# EAGLE design hybrid_lower_pcb3_3 (EAGLE 9.2.1)

## Sheet 1 of 8: micro,xbee,sd
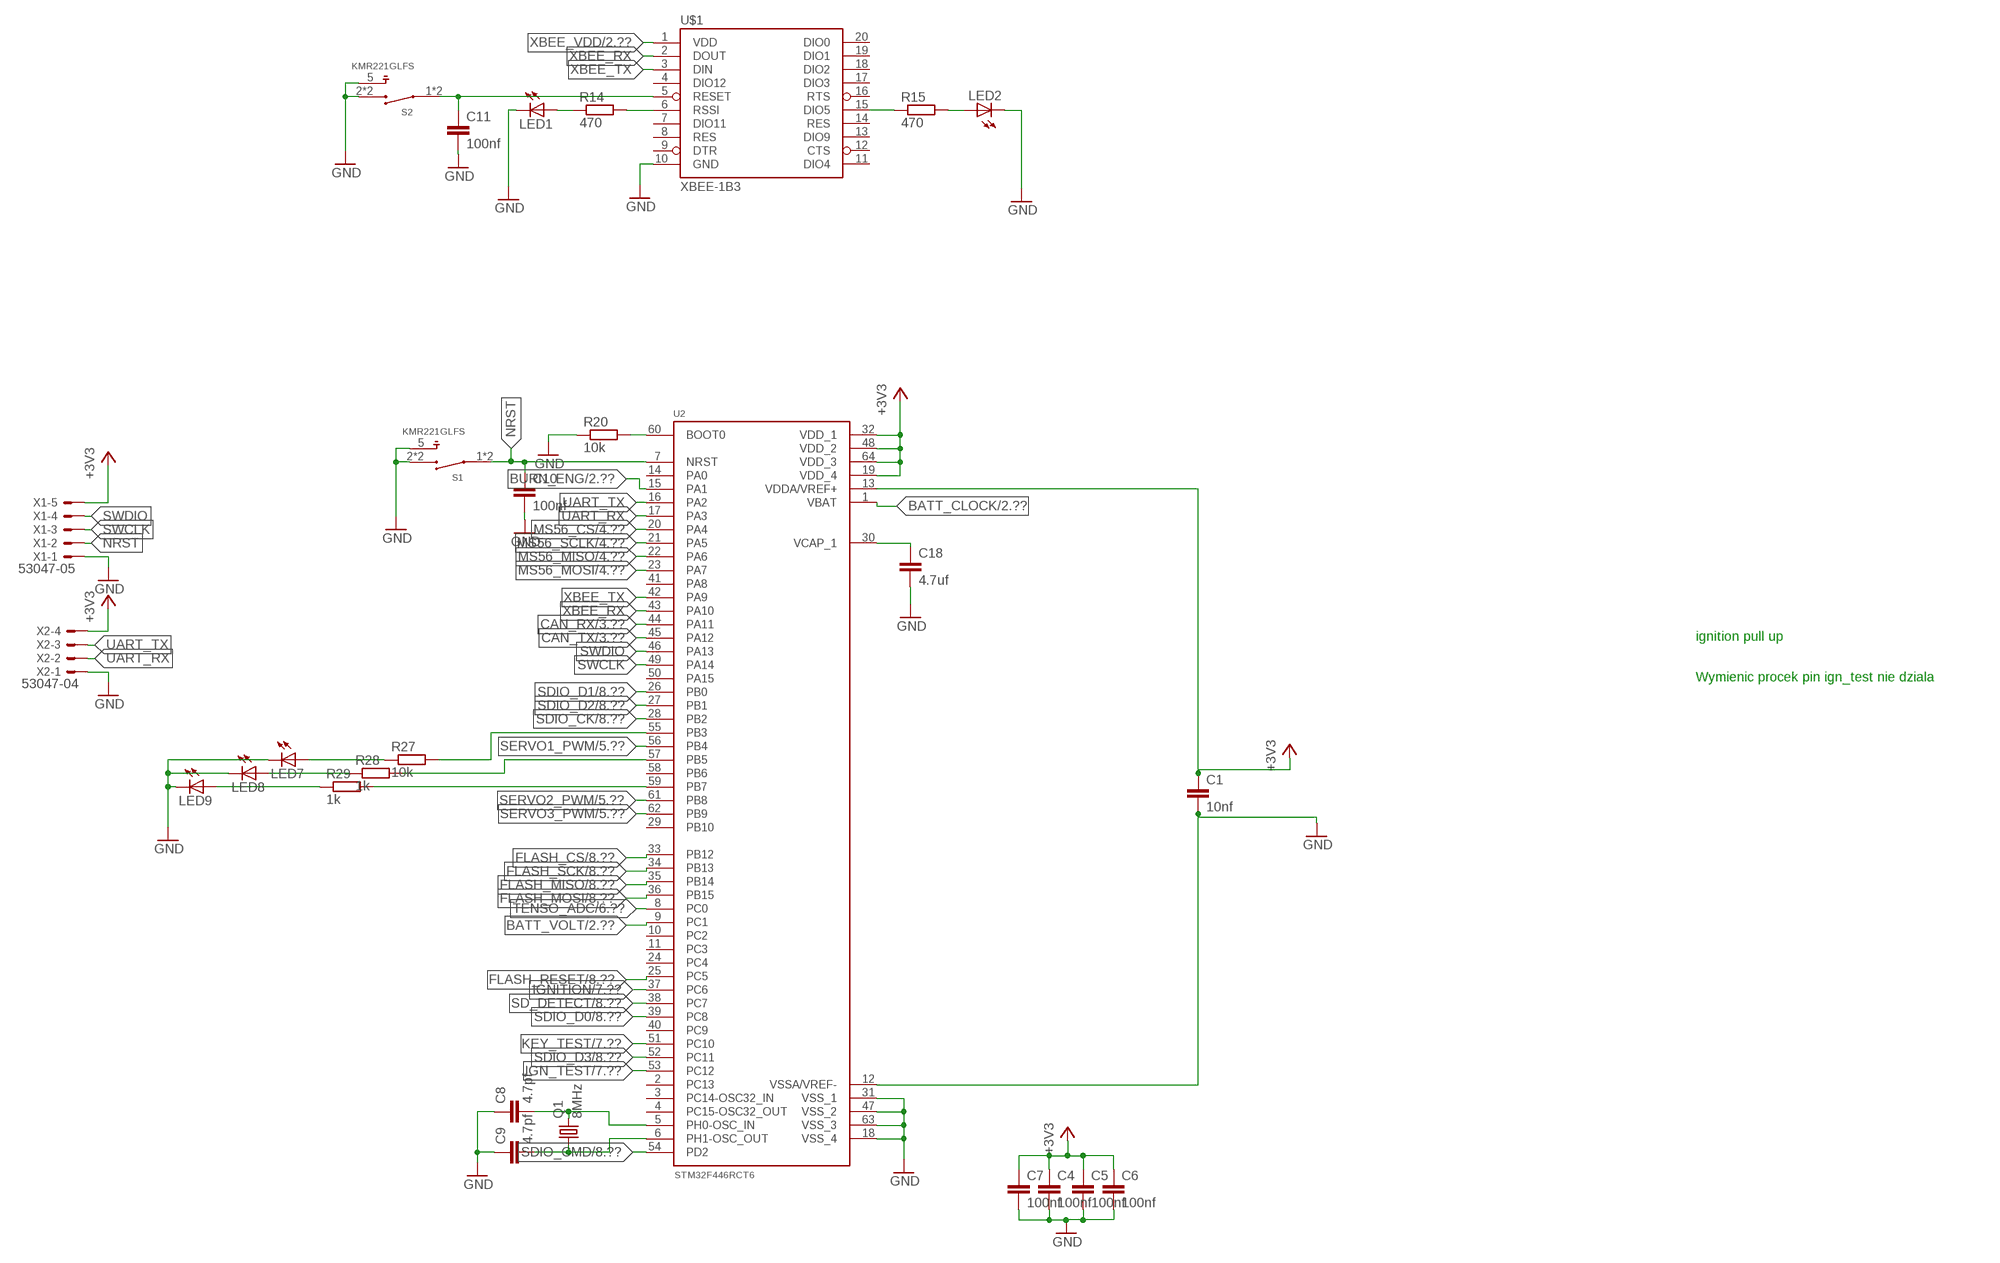
[diagram p0: schematic, sheet 1]

### Parts
C1  10nf  C-EUC0603  [C0603]
C4  100nf  C-EUC0603  [C0603]
C5  100nf  C-EUC0603  [C0603]
C6  100nf  C-EUC0603  [C0603]
C7  100nf  C-EUC0603  [C0603]
C8  4.7pf  C-EUC0603  [C0603]
C9  4.7pf  C-EUC0603  [C0603]
C10  100nf  C-EUC0603  [C0603]
C11  100nf  C-EUC0603  [C0603]
C18  4.7uf  C-EUC0805  [C0805]
LED1  LED0603  [LED-0603]
LED2  LED0603  [LED-0603]
LED7  LED0603  [LED-0603]
LED8  LED0603  [LED-0603]
LED9  LED0603  [LED-0603]
Q1  8MHz  CRYSTALCTS406  [CTS406]
R14  470  R-EU_R0603  [R0603]
R15  470  R-EU_R0603  [R0603]
R20  10k  R-EU_R0603  [R0603]
R27  10k  R-EU_R0603  [R0603]
R28  1k  R-EU_R0603  [R0603]
R29  1k  R-EU_R0603  [R0603]
S1  KMR221GLFS  [SW_KMR221GLFS]
S2  KMR221GLFS  [SW_KMR221GLFS]
U2  STM32F446RCT6  [QFP50P1200X1200X160-64N]
U$1  XBEE-1B3  [XBEE-SMD]
X1  53047-05  [53047-05]
X2  53047-04  [53047-04]

### Nets
+3V3: C1.1 C4.1 C5.1 C6.1 C7.1 U2.13(VDDA/VREF+) U2.19(VDD_4) U2.32(VDD_1) U2.48(VDD_2) U2.64(VDD_3) X1.5 X2.4 ; also sheet 2,3,4,5,7,8
BATT_CLOCK: U2.1(VBAT) ; also sheet 2
BATT_VOLT: U2.9(PC1) ; also sheet 2
BURN_ENG: U2.15(PA1) ; also sheet 2
CAN_RX: U2.44(PA11) ; also sheet 3
CAN_TX: U2.45(PA12) ; also sheet 3
DUPA: C11.1 S2.1 S2.4 U$1.5(RESET)
FLASH_CS: U2.33(PB12) ; also sheet 8
FLASH_MISO: U2.35(PB14) ; also sheet 8
FLASH_MOSI: U2.36(PB15) ; also sheet 8
FLASH_RESET: U2.25(PC5) ; also sheet 8
FLASH_SCK: U2.34(PB13) ; also sheet 8
GND: C1.2 C4.2 C5.2 C6.2 C7.2 C8.1 C9.1 C10.2 C11.2 C18.2 LED1.C LED2.C LED7.C LED8.C LED9.C R20.1 S1.2 S1.3 S1.5 S2.2 S2.3 S2.5 U2.12(VSSA/VREF-) U2.18(VSS_4) U2.31(VSS_1) U2.47(VSS_2) U2.63(VSS_3) U$1.10(GND) X1.1 X2.1 ; also sheet 2,3,4,5,6,7,8
IGN_TEST: U2.53(PC12) ; also sheet 7
IGNITION: U2.37(PC6) ; also sheet 7
KEY_TEST: U2.51(PC10) ; also sheet 7
MS56_CS: U2.20(PA4) ; also sheet 4
MS56_MISO: U2.22(PA6) ; also sheet 4
MS56_MOSI: U2.23(PA7) ; also sheet 4
MS56_SCLK: U2.21(PA5) ; also sheet 4
N$2: C18.1 U2.30(VCAP_1)
N$7: LED1.A R14.1
N$8: C8.2 Q1.3 U2.5(PH0-OSC_IN)
N$9: C9.2 Q1.1 U2.6(PH1-OSC_OUT)
N$11: LED2.A R15.2
N$18: R14.2 U$1.6(RSSI)
N$19: R15.1 U$1.15(DIO5)
N$29: R20.2 U2.60(BOOT0)
N$30: R27.2 U2.55(PB3)
N$33: R28.2 U2.57(PB5)
N$34: R29.2 U2.59(PB7)
N$36: LED7.A R27.1
N$37: LED8.A R28.1
N$38: LED9.A R29.1
NRST: C10.1 S1.1 S1.4 U2.7(NRST) X1.2
SD_DETECT: U2.38(PC7) ; also sheet 8
SDIO_CK: U2.28(PB2) ; also sheet 8
SDIO_CMD: U2.54(PD2) ; also sheet 8
SDIO_D0: U2.39(PC8) ; also sheet 8
SDIO_D1: U2.26(PB0) ; also sheet 8
SDIO_D2: U2.27(PB1) ; also sheet 8
SDIO_D3: U2.52(PC11) ; also sheet 8
SERVO1_PWM: U2.56(PB4) ; also sheet 5
SERVO2_PWM: U2.61(PB8) ; also sheet 5
SERVO3_PWM: U2.62(PB9) ; also sheet 5
SWCLK: U2.49(PA14) X1.3
SWDIO: U2.46(PA13) X1.4
TENSO_ADC: U2.8(PC0) ; also sheet 6
UART_RX: U2.17(PA3) X2.2
UART_TX: U2.16(PA2) X2.3
XBEE_RX: U2.43(PA10) U$1.2(DOUT)
XBEE_TX: U2.42(PA9) U$1.3(DIN)
XBEE_VDD: U$1.1(VDD) ; also sheet 2
Unconnected: U2.2(PC13) U2.3(PC14-OSC32_IN) U2.4(PC15-OSC32_OUT) U2.10(PC2) U2.11(PC3) U2.14(PA0) U2.24(PC4) U2.29(PB10) U2.40(PC9) U2.41(PA8) U2.50(PA15) U2.58(PB6) U$1.4(DIO12) U$1.7(DIO11) U$1.8(RES) U$1.9(DTR) U$1.11(DIO4) U$1.12(CTS) U$1.13(DIO9) U$1.14(RES) U$1.16(RTS) U$1.17(DIO3) U$1.18(DIO2) U$1.19(DIO1) U$1.20(DIO0)

### Notes on the sheet
- ignition pull up
- Wymienic procek pin ign_test nie dziala

## Sheet 2 of 8: supply
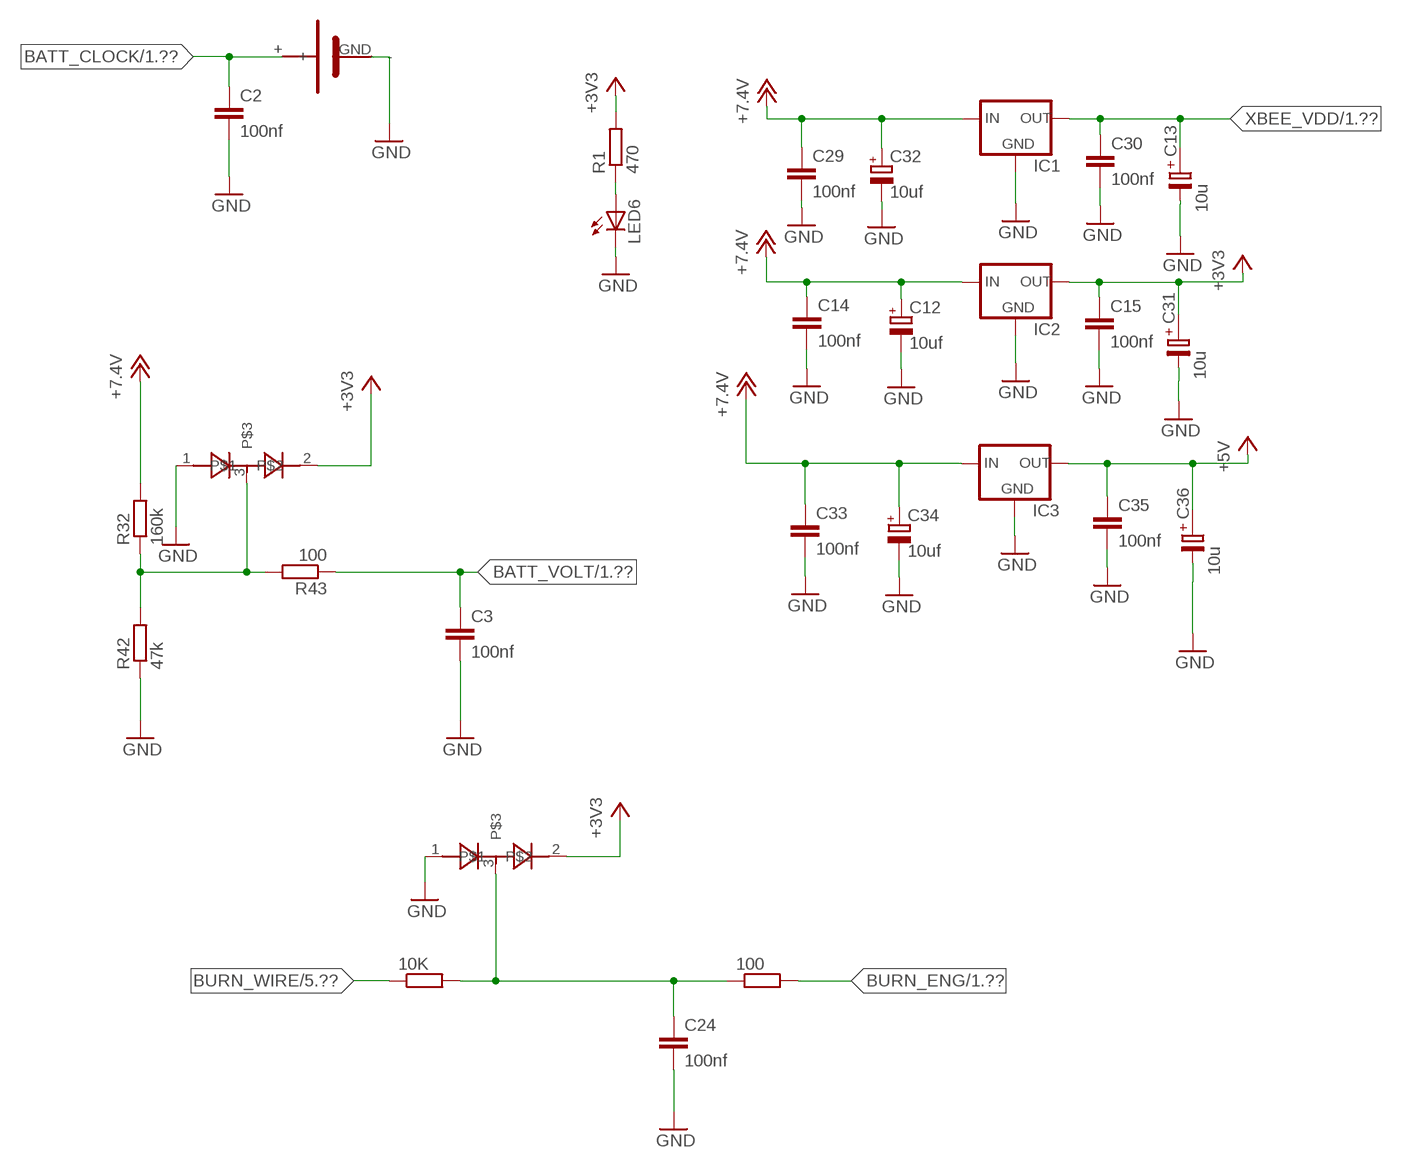
[diagram p1: schematic, sheet 2]

### Parts
10K  R-EU_R0603  [R0603]
100  R-EU_R0603  [R0603]
C2  100nf  C-EUC0603  [C0603]
C3  100nf  C-EUC0603  [C0603]
C12  10uf  CPOL-EUSANYO_SMD_B6  [SANYO-OSCON_SMD_B6]
C13  10u  C-PR-SMD-TE-B  [TE-B-3528]
C14  100nf  C-EUC0603  [C0603]
C15  100nf  C-EUC0603  [C0603]
C24  100nf  C-EUC0603  [C0603]
C29  100nf  C-EUC0603  [C0603]
C30  100nf  C-EUC0603  [C0603]
C31  10u  C-PR-SMD-TE-B  [TE-B-3528]
C32  10uf  CPOL-EUSANYO_SMD_B6  [SANYO-OSCON_SMD_B6]
C33  100nf  C-EUC0603  [C0603]
C34  10uf  CPOL-EUSANYO_SMD_B6  [SANYO-OSCON_SMD_B6]
C35  100nf  C-EUC0603  [C0603]
C36  10u  C-PR-SMD-TE-B  [TE-B-3528]
IC1  LM1117  [SOT223]
IC2  LM1117  [SOT223]
IC3  LM1117  [SOT223]
LED6  LED0603  [LED-0603]
R1  470  R-EU_R0603  [R0603]
R32  160k  R-EU_R0603  [R0603]
R42  47k  R-EU_R0603  [R0603]
R43  100  R-EU_R0603  [R0603]
U$13  CR1220_POZ  [CR1220_POZ]
U$17  BAS40W-04  [SOT65P210X110-3N]
U$19  BAS40W-04  [SOT65P210X110-3N]

### Nets
+3V3: C15.1 C31.+ IC2.2(OUT) R1.2 U$17.2 U$19.2 ; also sheet 1,3,4,5,7,8
+5V: C35.1 C36.+ IC3.2(OUT) ; also sheet 5,6
+12V: C12.+ C14.1 C29.1 C32.+ C33.1 C34.+ IC1.3(IN) IC2.3(IN) IC3.3(IN) R32.2 ; supply symbol labelled +7.4V ; also sheet 5,7
BATT_CLOCK: C2.1 U$13.+ ; also sheet 1
BATT_VOLT: C3.1 R43.1 ; also sheet 1
BURN_ENG: 100.2 ; also sheet 1
BURN_WIRE: 10K.1 ; also sheet 5
GND: C2.2 C3.2 C12.- C13.- C14.2 C15.2 C24.2 C29.2 C30.2 C31.- C32.- C33.2 C34.- C35.2 C36.- IC1.1(GND) IC2.1(GND) IC3.1(GND) LED6.C R42.1 U$13.GND(-) U$17.1 U$19.1 ; also sheet 1,3,4,5,6,7,8
N$6: R32.1 R42.2 R43.2 U$17.3
N$23: 10K.2 100.1 C24.1 U$19.3
N$28: LED6.A R1.1
XBEE_VDD: C13.+ C30.1 IC1.2(OUT) ; also sheet 1

## Sheet 3 of 8: CAN
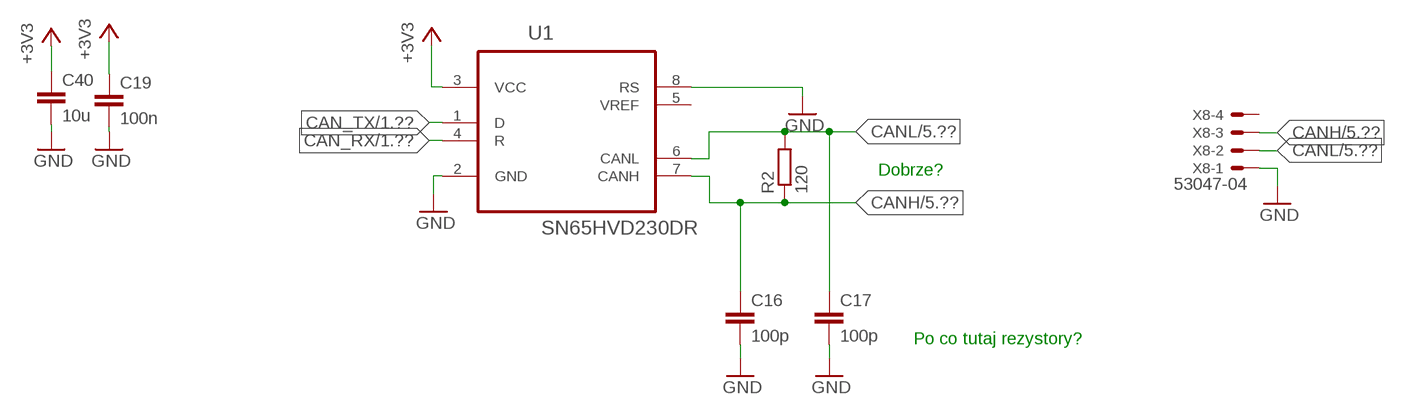
[diagram p2: schematic, sheet 3]

### Parts
C16  100p  C-EUC0603  [C0603]
C17  100p  C-EUC0603  [C0603]
C19  100n  C-EUC0603  [C0603]
C40  10u  C-EUC0805  [C0805]
R2  120  R-EU_R0603  [R0603]
U1  SN65HVD230DR  [SOIC127P600X175-8N]
X8  53047-04  [53047-04]

### Nets
+3V3: C19.1 C40.1 U1.3(VCC) ; also sheet 1,2,4,5,7,8
CAN_RX: U1.4(R) ; also sheet 1
CAN_TX: U1.1(D) ; also sheet 1
CANH: C16.1 R2.1 U1.7(CANH) X8.3 ; also sheet 5
CANL: C17.1 R2.2 U1.6(CANL) X8.2 ; also sheet 5
GND: C16.2 C17.2 C19.2 C40.2 U1.2(GND) U1.8(RS) X8.1 ; also sheet 1,2,4,5,6,7,8
Unconnected: U1.5(VREF) X8.4

### Notes on the sheet
- Dobrze?
- Po co tutaj rezystory?

## Sheet 4 of 8: Altimeter
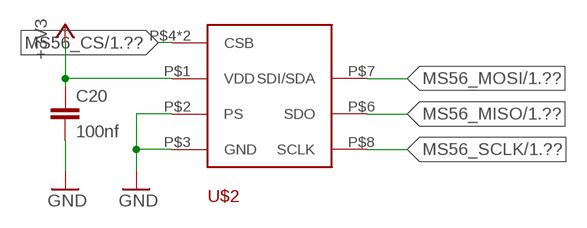
[diagram p3: schematic, sheet 4]

### Parts
C20  100nf  C-EUC0603  [C0603]
U$2  MS56XX  [MS56XX]

### Nets
+3V3: C20.1 U$2.P$1(VDD) ; also sheet 1,2,3,5,7,8
GND: C20.2 U$2.P$2(PS) U$2.P$3(GND) ; also sheet 1,2,3,5,6,7,8
MS56_CS: U$2.P$4(CSB) U$2.P$5(CSB) ; also sheet 1
MS56_MISO: U$2.P$6(SDO) ; also sheet 1
MS56_MOSI: U$2.P$7(SDI/SDA) ; also sheet 1
MS56_SCLK: U$2.P$8(SCLK) ; also sheet 1

## Sheet 5 of 8: connection
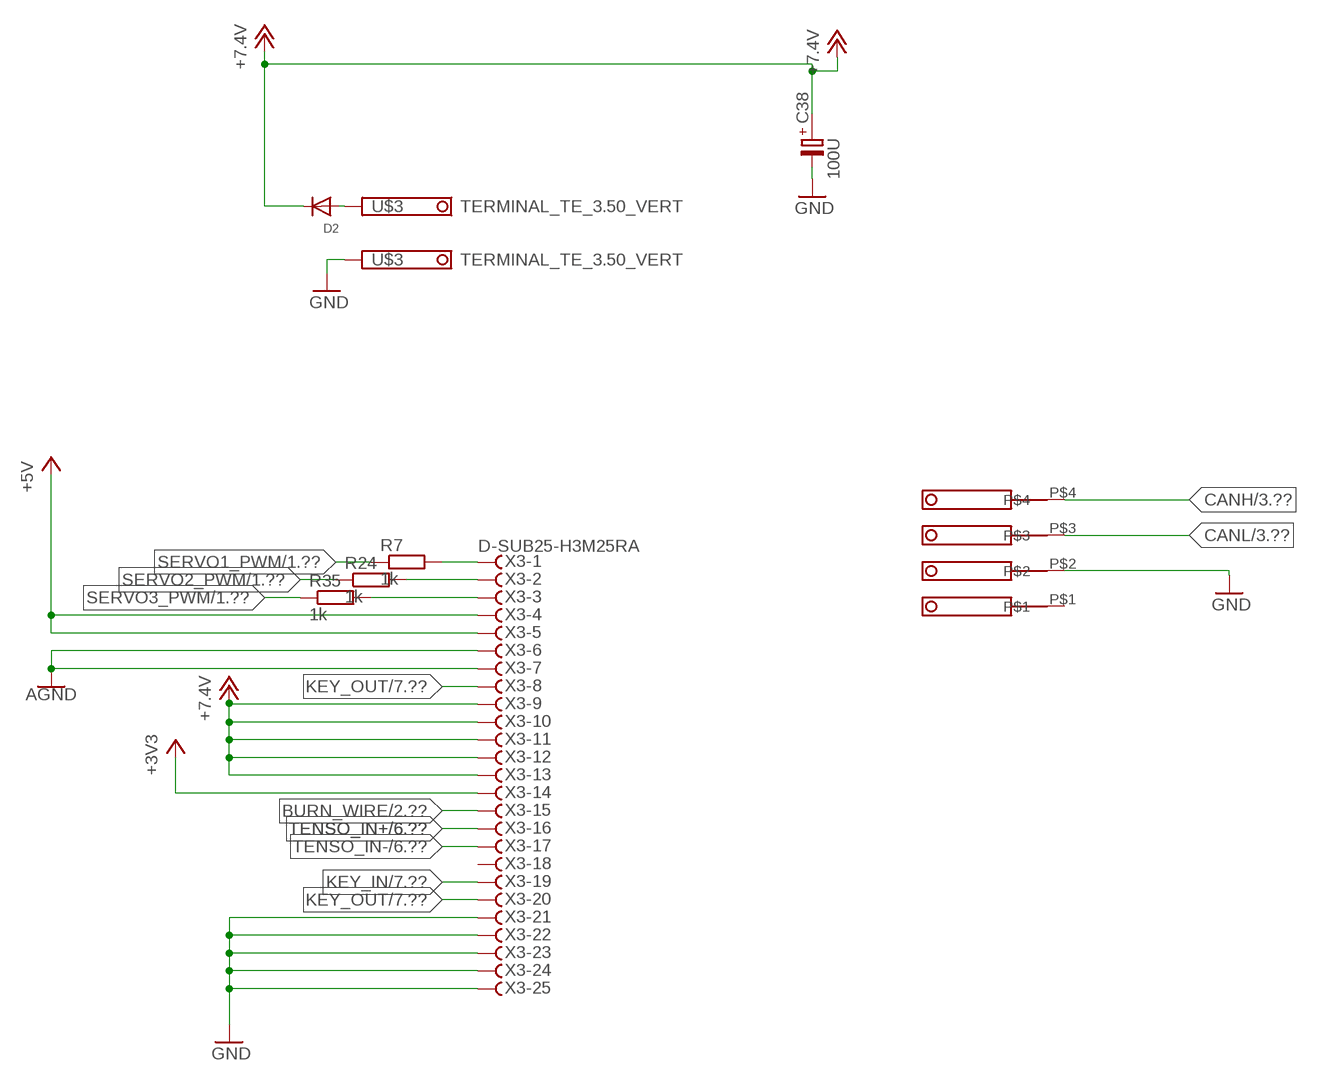
[diagram p4: schematic, sheet 5]

### Parts
C38  100U  C-PR-SMD-TE-B  [TE-B-3528]
D2  DIODESOD-523  [SOD-523]
R7  1k  R-EU_R0603  [R0603]
R24  1k  R-EU_R0603  [R0603]
R35  1k  R-EU_R0603  [R0603]
U$3  TERMINAL_TE_3.50_VERT  [TE_3.5_TERMINAL_VERT]
U$10  39505-1005  [39505-1005]
X3  D-SUB25-H3M25RA  [H3M25RA]

### Nets
+3V3: X3.14 ; also sheet 1,2,3,4,7,8
+5V: X3.4 X3.5 ; also sheet 2,6
+12V: C38.+ D2.K(C) X3.9 X3.10 X3.11 X3.12 X3.13 ; supply symbol labelled +7.4V ; also sheet 2,7
AGND: X3.6 X3.7 ; also sheet 6
BURN_WIRE: X3.15 ; also sheet 2
CANH: U$10.P$4 ; also sheet 3
CANL: U$10.P$3 ; also sheet 3
GND: C38.- U$3.P$2(K1) U$10.P$2 X3.21 X3.22 X3.23 X3.24 X3.25 ; also sheet 1,2,3,4,6,7,8
KEY_IN: X3.19 ; also sheet 7
KEY_OUT: X3.8 X3.20 ; also sheet 7
N$13: R7.2 X3.1
N$17: D2.A U$3.P$1(K)
N$41: R24.2 X3.2
N$42: R35.2 X3.3
SERVO1_PWM: R7.1 ; also sheet 1
SERVO2_PWM: R24.1 ; also sheet 1
SERVO3_PWM: R35.1 ; also sheet 1
TENSO_IN+: X3.16 ; also sheet 6
TENSO_IN-: X3.17 ; also sheet 6
Unconnected: U$10.P$1 X3.18

## Sheet 6 of 8
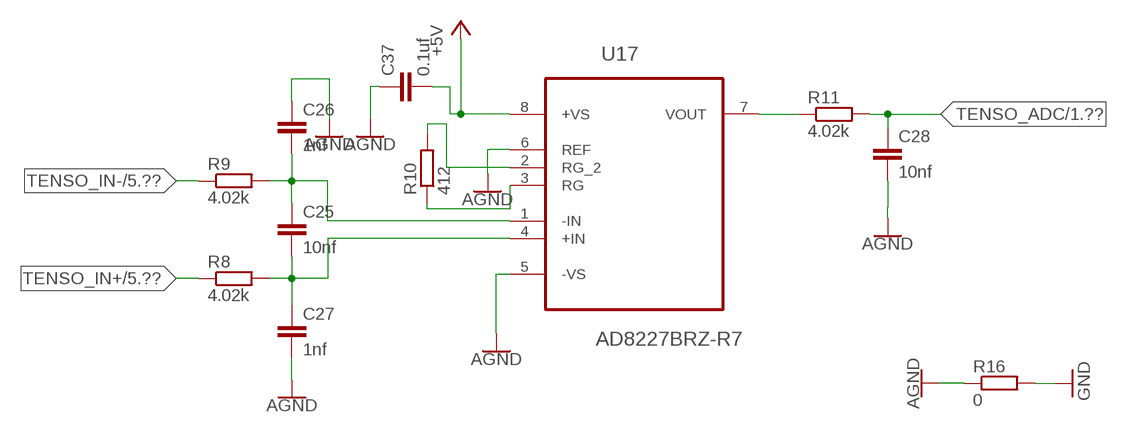
[diagram p5: schematic, sheet 6]

### Parts
C25  10nf  C-EUC0603  [C0603]
C26  1nf  C-EUC0603  [C0603]
C27  1nf  C-EUC0603  [C0603]
C28  10nf  C-EUC0603  [C0603]
C37  0.1uf  C-EUC0603  [C0603]
R8  4.02k  R-EU_R0603  [R0603]
R9  4.02k  R-EU_R0603  [R0603]
R10  412  R-EU_R0805  [R0805]
R11  4.02k  R-EU_R0603  [R0603]
R16  0  R-EU_R0603  [R0603]
U17  AD8227BRZ-R7  [SOIC127P600X175-8N]

### Nets
+5V: C37.2 U17.8(+VS) ; also sheet 2,5
AGND: C26.1 C27.2 C28.2 C37.1 R16.1 U17.5(-VS) U17.6(REF) ; also sheet 5
GND: R16.2 ; also sheet 1,2,3,4,5,7,8
N$3: C25.1 C26.2 R9.2 U17.1(-IN)
N$4: C25.2 C27.1 R8.2 U17.4(+IN)
N$10: R10.1 U17.3(RG)
N$15: R10.2 U17.2(RG_2)
N$16: R11.1 U17.7(VOUT)
TENSO_ADC: C28.1 R11.2 ; also sheet 1
TENSO_IN+: R8.1 ; also sheet 5
TENSO_IN-: R9.1 ; also sheet 5

## Sheet 7 of 8: Ignition
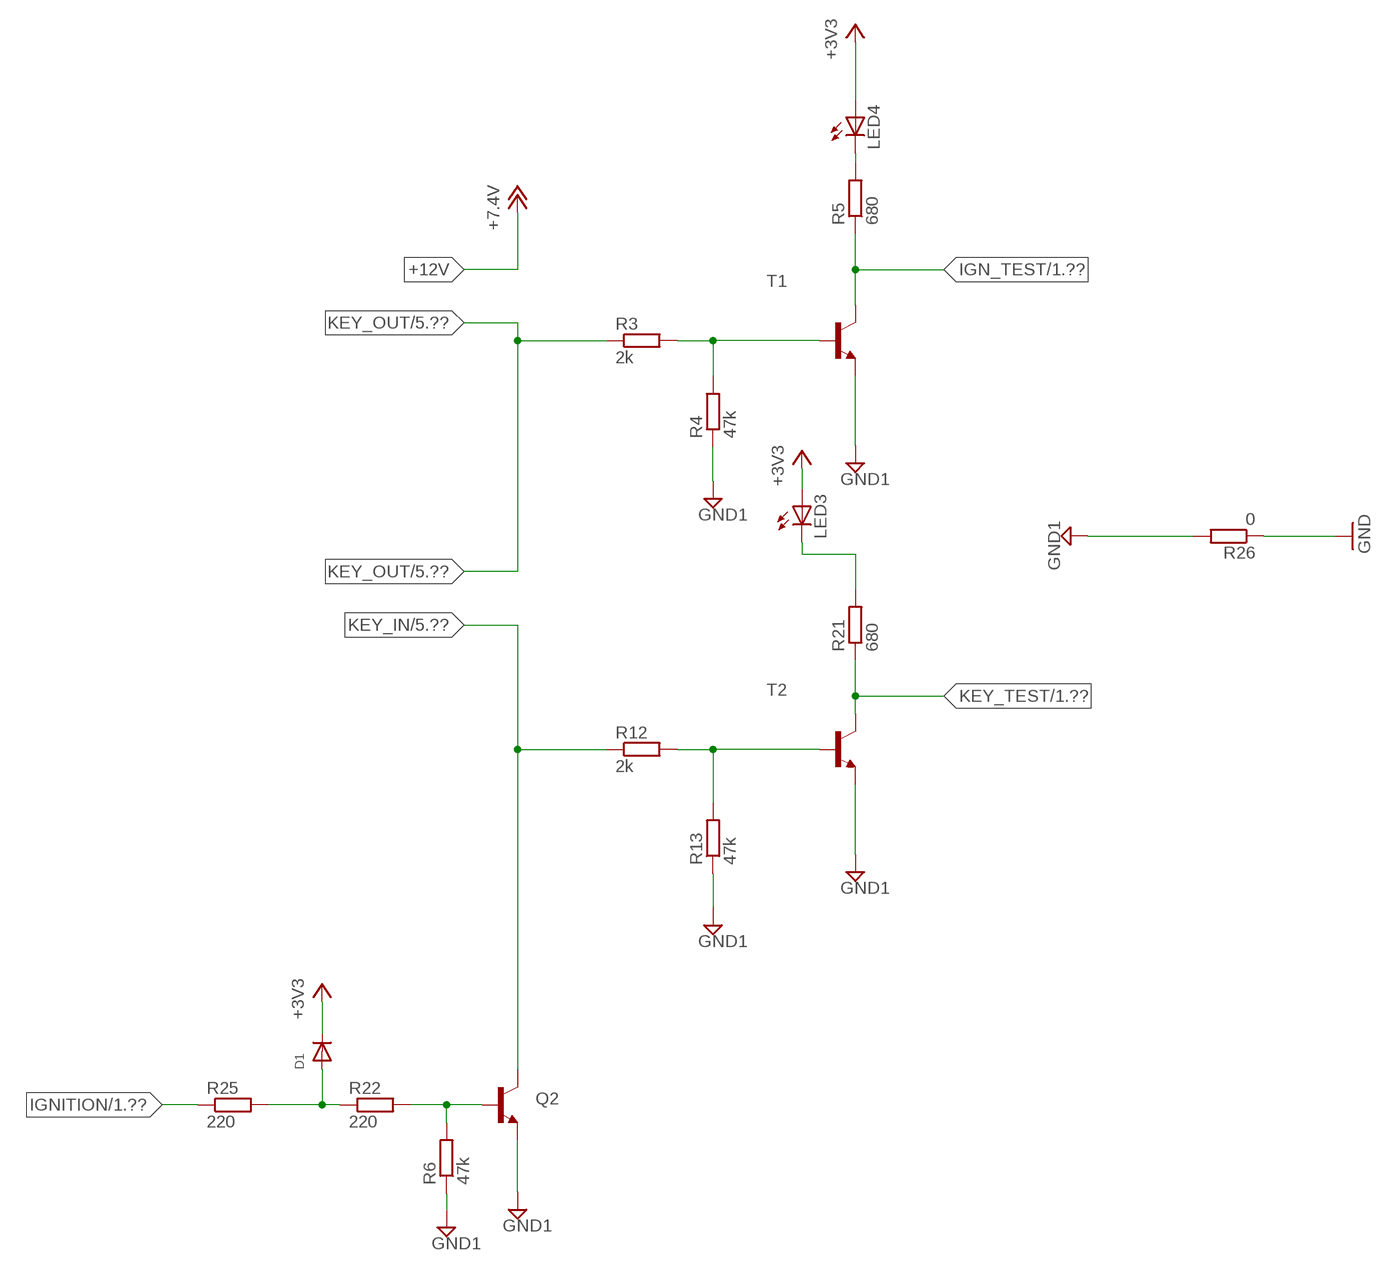
[diagram p6: schematic, sheet 7]

### Parts
D1  DIODESOD-523  [SOD-523]
LED3  LED0603  [LED-0603]
LED4  LED0603  [LED-0603]
Q2  TRANSISTOR_NPNSOT23-3  [SOT23-3]
R3  2k  R-EU_R0603  [R0603]
R4  47k  R-EU_R0603  [R0603]
R5  680  R-EU_R0603  [R0603]
R6  47k  R-EU_R0603  [R0603]
R12  2k  R-EU_R0603  [R0603]
R13  47k  R-EU_R0603  [R0603]
R21  680  R-EU_R0603  [R0603]
R22  220  R-EU_R0603  [R0603]
R25  220  R-EU_R0603  [R0603]
R26  0  R-EU_R0603  [R0603]
T1  BCW81-NPN-SOT23-BEC  [SOT23-BEC]
T2  BCW81-NPN-SOT23-BEC  [SOT23-BEC]

### Nets
+3V3: D1.K(C) LED3.A LED4.A ; also sheet 1,2,3,4,5,8
GND: R26.1 ; also sheet 1,2,3,4,5,6,8
GND1: Q2.2(E) R4.1 R6.1 R13.1 R26.2 T1.E T2.E
IGN_TEST: R5.1 T1.C ; also sheet 1
IGNITION: R25.1 ; also sheet 1
KEY_IN: Q2.3(C) R12.1 ; also sheet 5
KEY_OUT: R3.1 ; also sheet 5
KEY_TEST: R21.1 T2.C ; also sheet 1
N$5: R3.2 R4.2 T1.B
N$12: R12.2 R13.2 T2.B
N$20: LED4.C R5.2
N$21: LED3.C R21.2
N$31: Q2.1(B) R6.2 R22.2
N$35: D1.A R22.1 R25.2

## Sheet 8 of 8: Memory
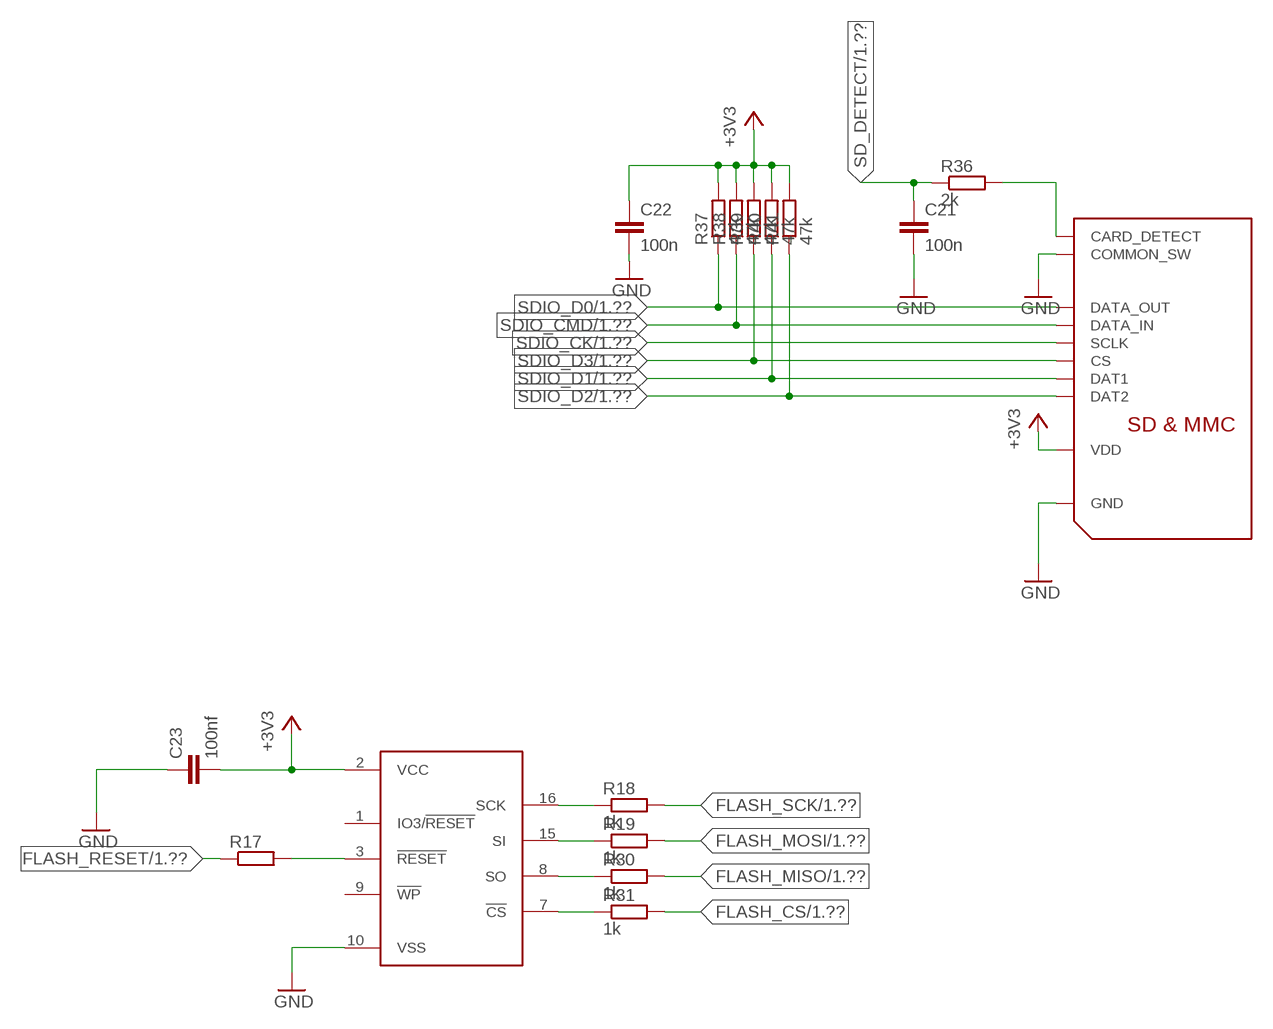
[diagram p7: schematic, sheet 8]

### Parts
C21  100n  C-EUC0603K  [C0603K]
C22  100n  C-EUC0603K  [C0603K]
C23  100nf  C-EUC0603  [C0603]
R17  R-EU_R0603  [R0603]
R18  1k  R-EU_R0603  [R0603]
R19  1k  R-EU_R0603  [R0603]
R30  1k  R-EU_R0603  [R0603]
R31  1k  R-EU_R0603  [R0603]
R36  2k  R-EU_R0603  [R0603]
R37  47k  R-EU_R0603  [R0603]
R38  47k  R-EU_R0603  [R0603]
R39  47k  R-EU_R0603  [R0603]
R40  47k  R-EU_R0603  [R0603]
R41  47k  R-EU_R0603  [R0603]
U$11  S25FLX  [SOIC16]
U$16  MOLEX_MICRO_SD_503182-1853  [MOLEX_MICRO_SD_503182-1853]

### Nets
+3V3: C22.1 C23.2 R37.2 R38.2 R39.2 R40.2 R41.2 U$11.2(VCC) U$16.PIN4(VDD) ; also sheet 1,2,3,4,5,7
FLASH_CS: R31.2 ; also sheet 1
FLASH_MISO: R30.2 ; also sheet 1
FLASH_MOSI: R19.2 ; also sheet 1
FLASH_RESET: R17.1 ; also sheet 1
FLASH_SCK: R18.2 ; also sheet 1
GND: C21.2 C22.2 C23.1 U$11.10(VSS) U$16.DETECT_GND(COMMON_SW) U$16.PIN6(GND) ; also sheet 1,2,3,4,5,6,7
N$1: R36.2 U$16.DETECT(CARD_DETECT)
N$14: R17.2 U$11.3(!RESET)
N$25: R18.1 U$11.16(SCK)
N$32: R19.1 U$11.15(SI)
N$39: R30.1 U$11.8(SO)
N$40: R31.1 U$11.7(!CS)
SD_DETECT: C21.1 R36.1 ; also sheet 1
SDIO_CK: U$16.PIN5(SCLK) ; also sheet 1
SDIO_CMD: R38.1 U$16.PIN3(DATA_IN) ; also sheet 1
SDIO_D0: R37.1 U$16.PIN7(DATA_OUT) ; also sheet 1
SDIO_D1: R40.1 U$16.PIN8(DAT1) ; also sheet 1
SDIO_D2: R41.1 U$16.PIN1(DAT2) ; also sheet 1
SDIO_D3: R39.1 U$16.PIN2(CS) ; also sheet 1
Unconnected: U$11.1(IO3/!RESET) U$11.9(!WP)

## Library data of the parts
10K 100 R7 R17-R19 R24 R30-R32 R35 R42 R43 = rcl:R-EU_: RESISTOR, European symbol; SPICEPREFIX: R
C1 C2 C4-C11 C14-C17 C19 C21 C22 C25-C30 C33 C35 C37 C40 = rcl:C-EU: CAPACITOR, European symbol
C3 C18 C23 C24 = rcl:C-EU: CAPACITOR, European symbol; SPICEPREFIX: C
C12 C32 C34 = rcl:CPOL-EU: POLARIZED CAPACITOR, European symbol; SPICEPREFIX: C
C13 C31 C36 C38 = capacitors:C-PR: POLARIZED ELECTROLYTIC/TANTALUM
C20 = resistor:C-EU: CAPACITOR, European symbol
D1 D2 = adafruit:DIODE: Diode SMADIODE - SMA Surface Mount Package 20V 1A Schottky Diode Digikey: 641-1014-6-ND DO-1N4148 - Through Hole Small Current Diode SOD-123 20V 1 A (.5mV Vf) Schottky Diode - Digikey: MBRX120TPMSCT-ND SOD-323 10V 570mA (.38mV Vf, 3ns) Schottky Diode - Digikey: ZLLS410CT-ND SOD-523 30V 30mA Schottky Diode (RB751S-40TE61) - Digikey: RB751S-40TE61CT-ND SOT23-R/W - SOT23 Package (R = Solder Paste/Reflow Ovens, W = Hand-Soldering) BAT54Film 40V 300mA - Digikey: 497-7162-1-ND
IC1-IC3 = v-reg-3:LM1117
LED1-LED4 LED6-LED9 = SparkFun:LED: LEDs Standard schematic elements and footprints for 5mm, 3mm, 1206, and 0603 sized LEDs. 5mm - Spark Fun Electronics SKU : COM-00529 (and others)
Q1 = crystal:CRYSTAL: CRYSTAL; OC_FARNELL: unknown; OC_NEWARK: unknown
Q2 = SparkFun:TRANSISTOR_NPN: Transistor NPN BJT configuration in SOT23 package. MMBT2222 is the common NPN we use. Double check BCE configuration again layout.
R1 R16 R20 R27-R29 = resistor:R-EU_: RESISTOR, European symbol
R2-R6 R8-R15 R21 R22 R25 R26 R36-R41 = rcl:R-EU_: RESISTOR, European symbol
S1 S2 = KMR221GLFS:KMR221GLFS: Switch Tactile N.O. SPST Button Gull Wing 0.05A 32VDC 1VA 200000Cycles 2N SMD Automotive T/R; AVAILABILITY: Good; DESCRIPTION: Switch Tactile N.O. SPST Button Gull Wing 0.05A 32VDC 1VA 200000Cycles 2N SMD Automotive T/R; MF: C&K Components; MP: KMR221GLFS; PACKAGE: None; PRICE: 0.28 USD
T1 T2 = DC_LOAD_AU:*-NPN-: NPN Transistror BF959 corrected 2008.03.06
U1 = SN65HVD230DR:SN65HVD230DR: 3.3-V CAN TRANSCEIVERS; AVAILABILITY: Good; DESCRIPTION: 3.3V CAN Transceiver with Standby Mode 8-SOIC -40 to 85; MF: Texas Instruments; MP: SN65HVD230DR; PACKAGE: SOIC-8 Texas Instruments; PRICE: 1.59 USD
U2 = STM32F446RCT6:STM32F446RCT6: 32 Bit Microcontroller, High Performance, ARM Cortex-M4, 180 MHz, 256 KB, 128 KB, 64, LQFP; AVAILABILITY: Good; DESCRIPTION: 32 Bit Microcontroller, High Performance, ARM Cortex-M4, 180 MHz, 256 KB, 128 KB, 64, LQFP; MF: STMicroelectronics; MP: STM32F446RCT6; PACKAGE: LQFP-64 STMicroelectronics; PRICE: 5.57 USD
U17 = Analog Devices_By_element14_Batch_1:AD8227BRZ-R7: Wide Supply Range, Rail-to-Rail Output Instrumentation Amplifier; MPN: AD8227BRZ-R7; OC_FARNELL: -; OC_NEWARK: 14R8723; PACKAGE: SOIC-8; SUPPLIER: Analog Devices
U$1 = SparkFun:XBEE-1
U$2 = MS56XX:MS56XX
U$3 = Terminal_TE_3.50:TERMINAL_TE_3.50_VERT
U$10 = 39505-1005:39505-1005
U$11 = s25FL:S25FLX
U$13 = SS_coin:CR1220_POZ
U$16 = SD_Reader:MOLEX_MICRO_SD_503182-1853
U$17 U$19 = BAS40w-0:BAS40W-04
X1 = con-molex:53?-05: CONNECTOR wire to board 1.25 mm (.049 inch) pitch header; MF: MOLEX; MPN: 53047-0510; OC_FARNELL: 9732861; OC_NEWARK: 38C9901
X2 X8 = con-molex:53?-04: CONNECTOR wire to board 1.25 mm (.049 inch) pitch header; MF: WALDOM/MOLEX; MPN: 53047-0410; OC_FARNELL: 9733060; OC_NEWARK: 38C9900
X3 = con-thomas-betts:D-SUB25-: D-Subminiatur Connector Source: Electronioc Interconnects European Edition 1998; OC_FARNELL: unknown; OC_NEWARK: unknown

## Board
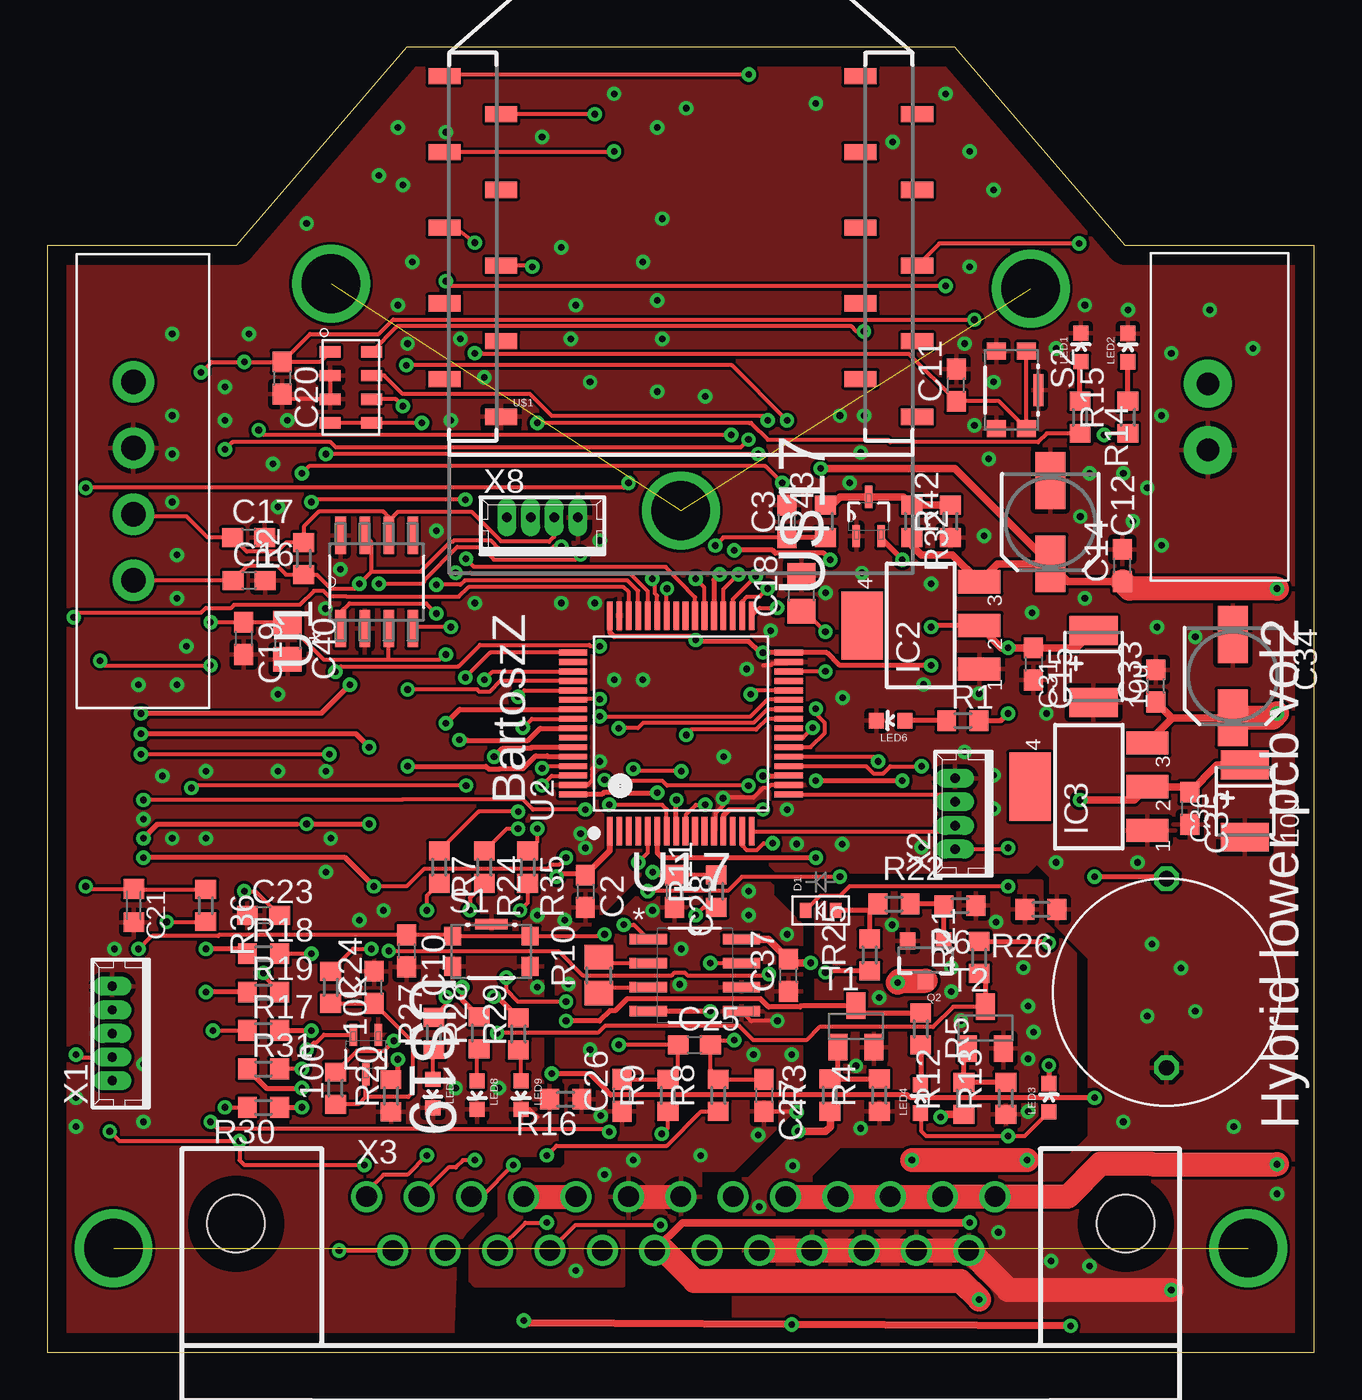
[diagram p8: board, top side]
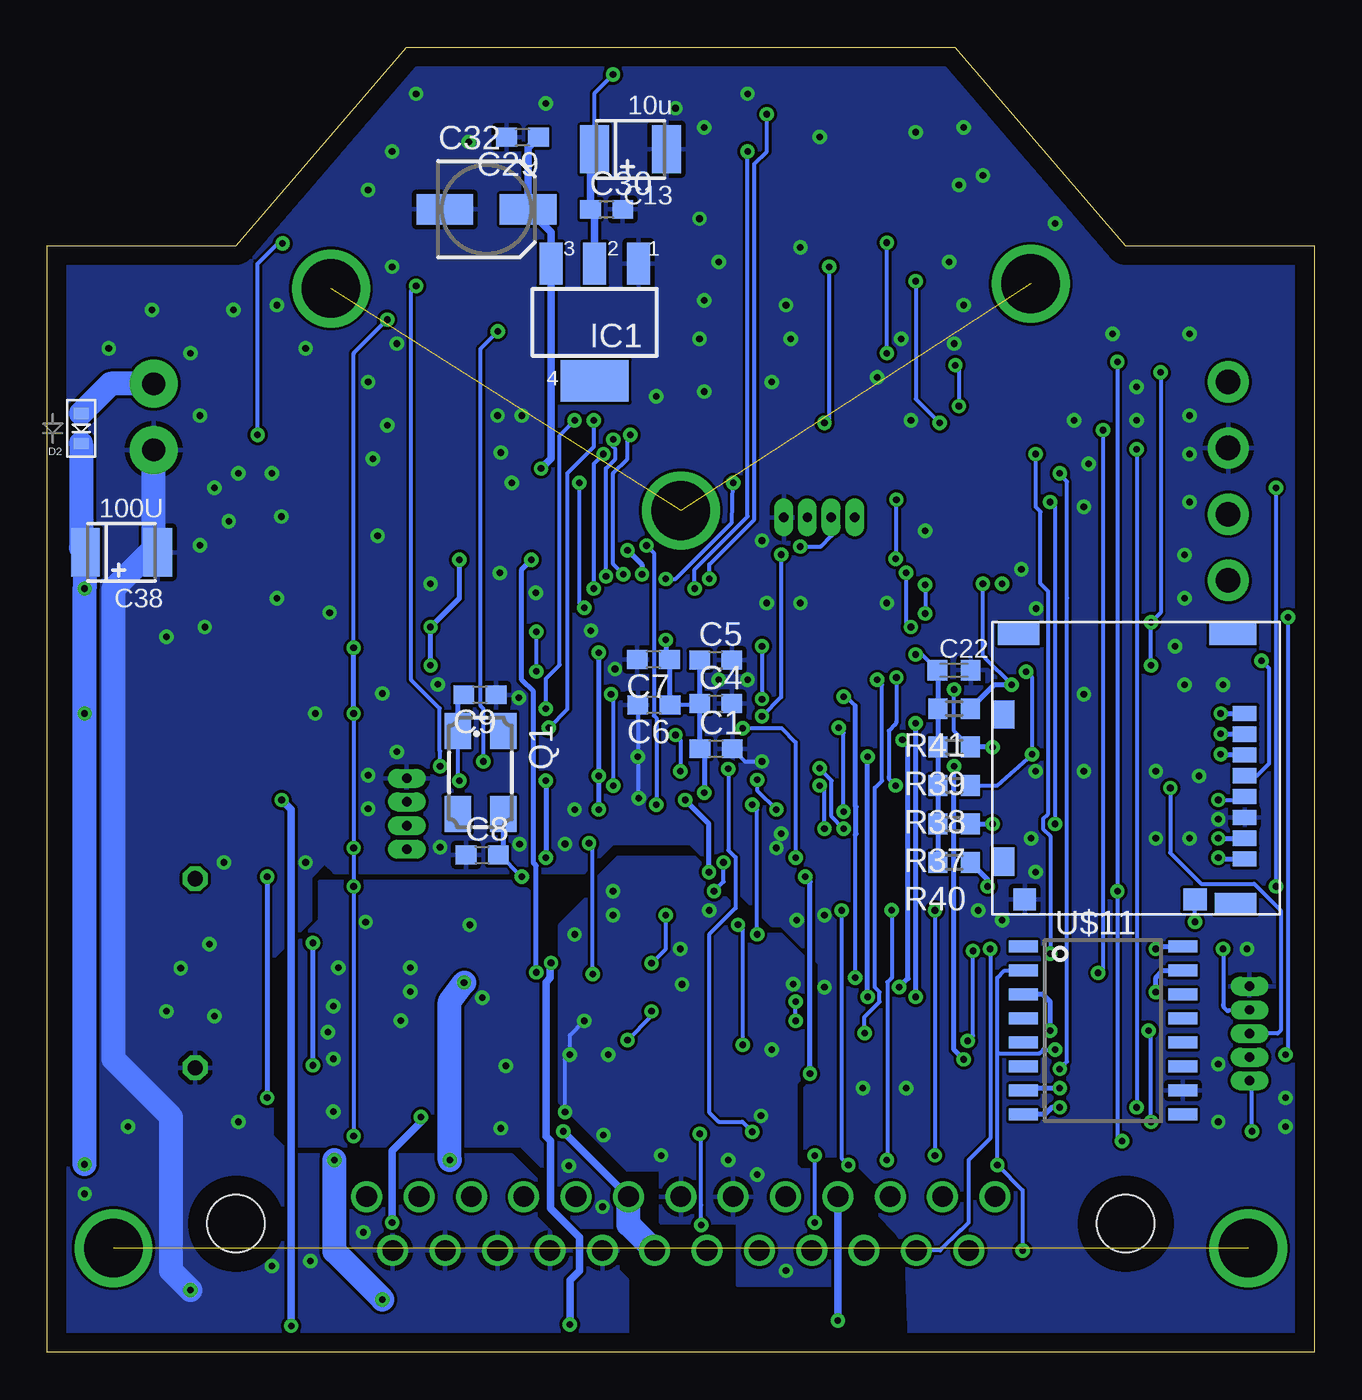
[diagram p9: board, bottom side, seen from below]

Size 67 x 69 mm. Coordinates in mm from the lower left corner, seen from the top.
Outline: 0,0 67,0 67,58.5 57,58.5 48,69 19,69 10,58.5 0,58.5 0,0
Copper layers (1*16): Top 0.035mm / dielectric 1.5mm / Bottom 0.035mm
Design rules "default *": minimum track width 6mil, minimum drill 0.35mm, track to track 6mil, track to pad 6mil, pad to pad 6mil, via to via 6mil, smd to smd 6mil, copper to edge 40mil, drill to drill 6mil, minimum pad ring 10mil, minimum via ring 8mil, stop-mask expansion 4mil, vias tented up to drill 15mil, thermal gap 10mil

### Footprints (pad centres in the part's own frame; a part is rotated, then mirrored left to right if it is on the bottom)
R0603 = smd 1 x 1.1: 1 -0.85,0; 2 0.85,0
C0603 = smd 1.1 x 1: 1 -0.85,0; 2 0.85,0
SANYO-OSCON_SMD_B6 = smd 3 x 1.6: + 2.2,0; - -2.2,0
TE-B-3528 = smd 1.524 x 2.54: + 1.905,0; - -1.905,0
C0805 = smd 1.3 x 1.5: 1 -0.95,0; 2 0.95,0
C0603K = smd 1.05 x 1.08: 1 -0.875,0; 2 0.875,0
SOD-523 = smd 0.8 x 0.6: A 0,-0.8; K 0,0.8
SOT223 = smd 1.219 x 2.235: 1 -2.311,-3.099; 2 0,-3.099; 3 2.311,-3.099 | smd 3.6 x 2.2: 4 0,3.099
LED-0603 = smd 0.8 x 0.8: A 0,-0.75; C 0,0.75
CTS406 = smd 1.9 x 1.4: 1 -2.2,-1.2; 2 2.2,-1.2; 3 2.2,1.2; 4 -2.2,1.2
SOT23-3 = smd 0.8 x 0.9: 1 -0.95,-1; 2 0.95,-1; 3 0,1.1
R0805 = smd 1.3 x 1.5: 1 -0.95,0; 2 0.95,0
SW_KMR221GLFS = smd 0.9 x 1: 1 -2.05,0.8; 2 -2.05,-0.8; 3 2.05,-0.8; 4 2.05,0.8 | smd 1.7 x 0.55: 5 0,1.425
SOT23-BEC = smd 1 x 1.4: B -0.95,-1.1; C 0,1.1; E 0.95,-1.1
SOIC127P600X175-8N = smd 1.981 x 0.559: 1 -2.464,1.905; 2 -2.464,0.635; 3 -2.464,-0.635; 4 -2.464,-1.905; 5 2.464,-1.905; 6 2.464,-0.635; 7 2.464,0.635; 8 2.464,1.905
QFP50P1200X1200X160-64N = smd 1.5 x 0.3: 1 -5.7,3.75; 2 -5.7,3.25; 3 -5.7,2.75; 4 -5.7,2.25; 5 -5.7,1.75; 6 -5.7,1.25; 7 -5.7,0.75; 8 -5.7,0.25; 9 -5.7,-0.25; 10 -5.7,-0.75; 11 -5.7,-1.25; 12 -5.7,-1.75; 13 -5.7,-2.25; 14 -5.7,-2.75; 15 -5.7,-3.25; 16 -5.7,-3.75; 33 5.7,-3.75; 34 5.7,-3.25; 35 5.7,-2.75; 36 5.7,-2.25; 37 5.7,-1.75; 38 5.7,-1.25; 39 5.7,-0.75; 40 5.7,-0.25; 41 5.7,0.25; 42 5.7,0.75; 43 5.7,1.25; 44 5.7,1.75; 45 5.7,2.25; 46 5.7,2.75; 47 5.7,3.25; 48 5.7,3.75 | smd 0.3 x 1.5: 17 -3.75,-5.7; 18 -3.25,-5.7; 19 -2.75,-5.7; 20 -2.25,-5.7; 21 -1.75,-5.7; 22 -1.25,-5.7; 23 -0.75,-5.7; 24 -0.25,-5.7; 25 0.25,-5.7; 26 0.75,-5.7; 27 1.25,-5.7; 28 1.75,-5.7; 29 2.25,-5.7; 30 2.75,-5.7; 31 3.25,-5.7; 32 3.75,-5.7; 49 3.75,5.7; 50 3.25,5.7; 51 2.75,5.7; 52 2.25,5.7; 53 1.75,5.7; 54 1.25,5.7; 55 0.75,5.7; 56 0.25,5.7; 57 -0.25,5.7; 58 -0.75,5.7; 59 -1.25,5.7; 60 -1.75,5.7; 61 -2.25,5.7; 62 -2.75,5.7; 63 -3.25,5.7; 64 -3.75,5.7
XBEE-SMD = smd 1.7 x 0.85: 1 -12.5,20; 2 -9.5,18; 3 -12.5,16; 4 -9.5,14; 5 -12.5,12; 6 -9.5,10; 7 -12.5,8; 8 -9.5,6; 9 -12.5,4; 10 -9.5,2; 11 12.5,2; 12 9.5,4; 13 12.5,6; 14 9.5,8; 15 12.5,10; 16 9.5,12; 17 12.5,14; 18 9.5,16; 19 12.5,18; 20 9.5,20
MS56XX = smd 1.1 x 0.6: P$1 -1.1,1.875; P$2 -1.1,0.625; P$3 -1.1,-0.625; P$4 -1.1,-1.875; P$5 1.1,-1.875; P$6 1.1,-0.625; P$7 1.1,0.625; P$8 1.1,1.875
TE_3.5_TERMINAL_VERT = drill 1.2 pad 2.54: P$1 1.75,-3; P$2 -1.75,-3
39505-1005 = drill 1.3 pad 2.184: P$1 -5.41,3.46; P$2 -1.91,3.46; P$3 1.59,3.46; P$4 5.09,3.46
SOIC16 = smd 0.635 x 1.524: 1 -4.445,-4.215; 2 -3.175,-4.215; 3 -1.905,-4.215; 4 -0.635,-4.215; 5 0.635,-4.215; 6 1.905,-4.215; 7 3.175,-4.215; 8 4.445,-4.215; 9 4.445,4.215; 10 3.175,4.215; 11 1.905,4.215; 12 0.635,4.215; 13 -0.635,4.215; 14 -1.905,4.215; 15 -3.175,4.215; 16 -4.445,4.215
CR1220_POZ = drill 0.8 octagon: + 6,0; GND -4,0
MOLEX_MICRO_SD_503182-1853 = smd 1.16 x 1.25: DETECT 14.66,10.7 | smd 1.16 x 1.2: DETECT_GND 14.66,1.7 | smd 1.15 x 2.5: P$9 0.635,12.7 | smd 1.15 x 2.2: P$10 0.625,1.37 | smd 1.5 x 1.15: P$11 4.88,0.575; P$12 12.66,0.575 | smd 1.12 x 2.2: P$15 14.865,12.85 | smd 0.8 x 1.24: PIN1 4.82,13.33; PIN2 5.92,13.33; PIN3 7.02,13.33; PIN4 8.12,13.33; PIN5 9.22,13.33; PIN6 10.32,13.33; PIN7 11.42,13.33; PIN8 12.52,13.33
SOT65P210X110-3N = smd 1.168 x 0.406: 1 -1.041,0.66; 2 -1.041,-0.66; 3 1.041,0
53047-05 = drill 0.5 pad 0.698 long: 1 2.5,0.45; 2 1.25,0.45; 3 0,0.45; 4 -1.25,0.45; 5 -2.5,0.45
53047-04 = drill 0.5 pad 0.698 long: 1 1.875,0.45; 2 0.625,0.45; 3 -0.625,0.45; 4 -1.875,0.45
H3M25RA = drill 1.092: 1 -16.612,1.422; 2 -13.843,1.422; 3 -11.074,1.422; 4 -8.306,1.422; 5 -5.537,1.422; 6 -2.769,1.422; 7 0,1.422; 8 2.769,1.422; 9 5.537,1.422; 10 8.306,1.422; 11 11.074,1.422; 12 13.843,1.422; 13 16.612,1.422; 14 -15.227,-1.422; 15 -12.459,-1.422; 16 -9.69,-1.422; 17 -6.921,-1.422; 18 -4.153,-1.422; 19 -1.384,-1.422; 20 1.384,-1.422; 21 4.153,-1.422; 22 6.921,-1.422; 23 9.69,-1.422; 24 12.459,-1.422; 25 15.227,-1.422 | hole 3.048: -23.52,0; 23.52,0

### Placement (x,y rotation side)
10K  14.99,19.3 270 top
100  15.24,13.96 90 top
C1  31.63,31.91 0 bottom
C2  28.45,24.38 270 top
C3  39.12,43.93 90 top
C4  31.65,34.29 0 bottom
C5  31.65,36.59 0 bottom
C6  34.93,34.23 180 bottom
C7  34.96,36.63 180 bottom
C8  44,26.29 0 bottom
C9  44.12,34.76 180 bottom
C10  19,21.22 270 top
C11  48.06,51.13 90 top
C12  53.04,43.89 270 top
C13  36.15,63.6 180 bottom
C14  56.85,41.6 90 top
C15  52.15,36.39 270 top
C16  10.68,40.81 0 top
C17  10.64,43.08 0 top
C18  39.88,40.12 90 top
C19  10.38,37.75 270 top
C20  12.41,51.51 270 top
C21  4.57,23.61 270 top
C22  19.05,36.06 0 bottom
C23  11.43,23.11 0 top
C24  17.27,19.3 90 top
C25  34.21,16.25 0 top
C26  30.4,13.58 90 top
C27  37.89,13.58 270 top
C28  33.16,24.38 270 top
C29  41.87,64.24 180 bottom
C30  37.42,60.43 0 bottom
C31  55.33,36.25 90 top
C32  43.77,60.43 0 bottom
C33  58.63,35.23 90 top
C34  62.69,35.74 270 top
C35  60.41,28.76 270 top
C36  63.33,29.14 90 top
C37  39.2,19.93 90 top
C38  63.07,42.29 180 bottom
C40  12.7,37.58 270 top
D1  40.89,23.36 90 top
D2  65.21,48.85 180 bottom
IC1  38.06,54.46 180 bottom
IC2  46.18,38.43 90 top
IC3  55.07,29.9 90 top
LED1  54.65,53.13 0 top
LED2  57.13,53.12 0 top
LED3  52.96,13.45 0 top
LED4  46.16,13.39 0 top
LED6  44.6,33.39 90 top
LED7  20.39,13.68 180 top
LED8  22.72,13.6 180 top
LED9  25.05,13.6 180 top
Q1  44.09,30.65 270 bottom
Q2  46.45,20.74 180 top
R1  48.41,33.39 0 top
R2  13.56,41.97 90 top
R3  41.38,13.6 90 top
R4  44,13.6 90 top
R5  46.18,17.1 270 top
R6  48.26,23.61 180 top
R7  20.73,25.65 270 top
R8  35.48,13.58 90 top
R9  32.81,13.58 90 top
R10  29.16,19.93 90 top
R11  35.37,24.38 90 top
R12  48.47,13.42 90 top
R13  50.68,13.42 90 top
R14  54.61,49.44 270 top
R15  57.13,49.44 90 top
R16  27.41,13.38 180 top
R17  11.43,17.01 0 top
R18  11.43,21.07 0 top
R19  11.43,19.04 0 top
R20  18.17,13.56 90 top
R21  49.27,20.87 90 top
R22  44.77,23.7 0 top
R24  23.11,25.65 270 top
R25  43.48,21 90 top
R26  52.53,23.42 180 top
R27  20.44,16.85 90 top
R28  22.83,16.88 90 top
R29  24.91,16.83 90 top
R30  11.43,12.95 180 top
R31  11.43,14.98 0 top
R32  45.72,43.93 270 top
R35  25.4,25.65 270 top
R36  8.38,23.61 270 top
R37  19.05,27.93 180 bottom
R38  19.05,29.96 180 bottom
R39  19.05,32 180 bottom
R40  19.05,25.9 180 bottom
R41  19.05,34.03 180 bottom
R42  47.75,43.93 90 top
R43  41.15,43.93 90 top
S1  23.48,21.2 0 top
S2  50.98,50.88 270 top
T1  42.76,17.23 0 top
T2  49.6,17.16 0 top
U1  17.42,40.73 90 top
U2  33.5,33.24 90 top
U17  34.24,19.93 0 top
U$1  33.5,47.46 0 top
U$2  16.05,51.02 0 top
U$3  58.37,49.46 90 top
U$10  1.1,45.9 270 top
U$11  11.18,17.01 270 bottom
U$13  59.18,19.04 90 top
U$15  [LOGO]  12.72,16.34 90 top
U$16  17.02,38.6 270 bottom
U$17  43.43,44.19 90 top
U$19  16.84,15.74 270 top
X1  3.88,16.85 90 top
X2  48.44,28.47 90 top
X3  33.5,6.8 0 top
X8  26.18,43.69 0 top

### Tracks (layer width: path | path; a pad name or v marks a point on that pad's centre or on a via)
+3V3  (via drill 0.35)
  Top 0.203: X2.4 50.74,26.6 v50.8,26.66 | C40.1 12.63,38.6 C19.1 v8.64,38.6 | C40.1 12.77,38.53 | C20.1 14.42,52.36 U$2.P$1 | v49.02,54.6 18.29,54.6 17.53,53.84 13.89,53.84 C20.1 | C20.1 v10.41,52.36 8.68,52.36 v8.13,51.81 | v3.3,11.68 3.81,11.17 v10.16,11.17 10.16,10.15 10.41,9.9 v16.76,9.9 | v10.41,24.38 11.01,24.38 C23.2 | v2.79,36.57 3.05,36.31 v8.64,36.31 | LED3.A 51.68,11.42 v50.8,11.42 46.48,11.42 46.23,11.68 46.23,12.58 LED4.A | v50.8,24.63 42.42,24.63 41.91,24.12 40.86,24.12 D1.K | C40.1 14.62,36.61 18.03,36.61 | 18.03,36.61 20.73,36.61 21,36.89 v21.08,36.89 | 18.03,36.61 18.05,36.63 U1.3 | v15.43,5.38 X3.14 | v13.72,15.99 14.1,16.38 14.23,16.38 14.63,16.78 U$19.2
  Top 0.254: R1.2 50.42,33.39 v50.8,33.77 | IC2.2 46.82,38.43 v46.74,38.35 | v46.74,36.31 46.7,36.35 41.87,36.35 41.22,36.99 U2.32 v37.85,36.99 37.67,36.99 37.08,37.58 34.37,37.58 v34.29,37.66 34.11,37.84 29.97,37.84 29.75,38.06 U2.48 | v37.85,30.47 39.18,30.47 U2.19 | v45.21,41.9 44.09,43.02 U$17.2 | U2.64 29.33,29.49 29.45,29.61 29.99,29.61 30.02,29.58 v32.26,29.58 | U2.13 35.75,28.38 36.07,28.69 v37.85,28.69
  Top 0.406: IC2.2 50.46,37.24 v50.8,37.24 C15.1 54.41,37.24 C31.+
  Bottom 0.203: v50.8,33.77 v50.8,26.66 v50.8,24.63 v50.8,11.42 | v50.8,37.24 50.8,52.82 v49.02,54.6 | v8.13,51.81 8.13,39.11 v8.64,38.6 v8.64,36.31 | v10.41,52.36 v10.41,24.38 10.41,11.42 v10.16,11.17 | v3.3,11.68 3.3,14.22 X1.5 | 16.76,15.74 v16.76,9.9 15.43,8.56 v15.43,5.38 | 16.76,15.74 16.76,19.8 16.38,20.19 U$11.2 | C22.1 20.76,36.89 v21.08,36.89 | v2.79,36.57 2.39,36.16 2.39,31.13 3.04,30.48 U$16.PIN4 | C4.1 32.57,34.23 C6.1 | v13.72,15.99 14.33,15.99 14.52,15.8 16.7,15.8 16.76,15.74
  Bottom 0.254: v50.8,33.77 v50.8,37.24 | C5.1 C4.1 32.5,31.93 C1.1 32.26,31.69 v32.26,29.58 | C6.1 34.11,34.26 C7.1 34.29,36.81 v34.29,37.66 | v46.74,36.31 v46.74,38.35 45.21,39.87 v45.21,41.9 | v37.85,36.99 v37.85,30.47 v37.85,28.69 | C22.1 19.9,36.03 R41.2 R39.2 R38.2 R37.2 R40.2
+5V  (via drill 0.35)
  Top 0.406: C36.+ 61.84,31.04 C35.1 60.11,29.9 IC3.2 57.47,29.2 v54.61,29.2 | U17.8 38.14,21.84 C37.2 39.39,20.59 v40.36,20.59 | v54.1,1.39 v39.37,1.47 25.32,1.55 v25.2,1.67
  Top 1.27: X3.4 X3.5
  Bottom 0.406: v54.61,29.2 54.1,28.69 v54.1,1.39 | v25.2,1.67 X3.4 | v39.37,1.47 39.37,3.8 38.86,4.31 38.86,6.09 40.39,7.61 40.39,11.17 40.64,11.42 40.64,19.56 40.41,19.78 40.41,20.54 v40.36,20.59
+12V  (via drill 0.35)
  Top 0.406: C14.1 53.98,40.75 C12.+ | C12.+ 50.23,41.69 IC2.3 47.86,42.16 46.23,42.16 45.72,42.66 R32.2 | C34.+ 59.47,33.54 | 59.47,33.54 C33.1 | 59.47,33.54 59.47,33.51 IC3.3 | C12.+ 48,46.73 v40.89,46.73
  Top 1.27: X3.9 X3.10 X3.11 X3.12 X3.13 53.95,8.22 55.7,9.98 58.34,9.98 58.37,9.94 v65.02,9.94 | v65.02,33.77 64.79,33.54 C34.+ | v65.02,40.38 57.22,40.38 C14.1
  Bottom 0.406: v40.89,46.73 40.37,47.25 IC1.3 40.37,59.22 C32.+ 41.57,63.68 C29.1
  Bottom 1.27: D2.K 65.21,42.52 C38.+ 65.02,42.25 v65.02,40.38 v65.02,33.77 v65.02,9.94
AGND  (via drill 0.35)
  Top 0.203: C27.2 39.59,12.73 v39.62,12.69 | v38.61,17.52 37.22,17.52 U17.5
  Top 1.27: X3.6 X3.7
  Bottom 0.203: v39.62,12.69 39.62,15.49 v39.37,15.74 39.37,16.76 v38.61,17.52
  other vias: 28.7,15.99 37.34,15.74 37.59,11.49 33.44,19.45 33.53,21.33 37.08,24.38 39.12,22.09 32,23.36 29.26,12.5 27.56,19.46 29.46,9.39 34.54,10.41 30.99,10.15 27.94,4.31 37.08,23.11
  pour Bottom: 23.88,9.14 23.88,7.1 22.35,5.58 22.35,3.8 22.61,3.55 30.48,3.55 30.48,6.85 34.54,6.85 34.54,9.64 36.32,9.64 39.88,13.2 39.88,22.6 38.35,24.12 38.35,24.63 36.83,26.15 32.77,26.15 31.5,24.88 31.5,24.12 31.24,24.12 29.21,22.09 28.19,22.09 26.92,20.82 26.92,14.72 27.43,14.22 27.43,9.9 27.18,9.64 24.38,9.64
  pour Top: 23.88,9.14 23.88,7.1 22.35,5.58 22.35,3.8 22.61,3.55 30.48,3.55 30.48,6.85 34.54,6.85 34.54,9.64 36.32,9.64 39.88,13.2 39.88,22.6 38.35,24.12 38.35,24.63 36.83,26.15 32.77,26.15 31.5,24.88 31.5,24.12 31.24,24.12 29.21,22.09 28.19,22.09 26.92,20.82 26.92,14.72 27.43,14.22 27.43,9.9 27.18,9.64 24.38,9.64
BATT_CLOCK  (via drill 0.35)
  Top 0.254: U$13.+ 59.09,25.14 v55.37,25.14 | v55.37,13.45 v55.37,13.46 45.65,13.46 45.51,13.6 29.79,13.6 29.62,13.77 29.62,13.8 28.7,14.72 v26.67,14.72 | v26.92,25.14 27.09,25.31 28.53,25.31
  Top 0.305: C2.1 28.53,25.31 29.75,26.53 U2.1
  Bottom 0.254: v55.37,25.14 v55.37,13.45 | v26.67,14.72 26.67,24.88 v26.92,25.14
BATT_VOLT  (via drill 0.35)
  Top 0.203: 39.03,43.17 C3.1 35.74,43.08 v35.31,42.65 | U2.9 33.78,27.57 33.78,28.44 34.29,28.95 v34.8,28.95
  Top 0.254: R43.1 C3.1
  Bottom 0.203: v34.8,28.95 34.8,33.54 34.92,33.66 34.92,42.26 v35.31,42.65
BURN_ENG  (via drill 0.35)
  Top 0.203: v38.35,26.91 37.88,26.91 37.51,26.54 36.99,26.54 36.75,26.78 U2.15 | v18.05,21.22 27.02,21.22 28.31,19.93 33.03,19.93 33.18,20.08 33.7,20.08 33.85,19.93 38.09,19.93 v38.16,20 | 100.2 16.37,15.94 17.81,15.94 17.96,16.09 17.96,16.1 v18.33,16.46
  Bottom 0.203: v38.16,20 38.16,26.72 v38.35,26.91 | v18.33,16.46 18.05,16.74 v18.05,21.22
BURN_WIRE  (via drill 0.35)
  Top 0.203: 10K.1 16.17,21.33 v17.14,21.33
  Bottom 0.203: v17.14,21.33 17.14,11.3 18.29,10.15 18.29,6.85 18.69,6.45 18.72,6.45 19.79,5.38 X3.15
CAN_RX  (via drill 0.35)
  Top 0.203: v21.34,38.35 19.4,38.35 U1.4 | v21.59,41.21 22.37,41.21 22.41,41.17 30.83,41.17 31.75,40.25 U2.44
  Bottom 0.203: v21.59,41.21 21.59,38.6 v21.34,38.35
CAN_TX  (via drill 0.35)
  Top 0.203: U1.1 15.51,39.13 15.98,39.59 20.04,39.59 v20.57,39.06 | U2.45 31.24,40.25 30.68,40.81 22.09,40.81 21.85,40.58 v20.57,40.58
  Bottom 0.203: v20.57,40.58 v20.57,39.06
CANH  (via drill 0.35)
  Top 0.203: U$10.P$4 C16.1 10.58,41.56 12.18,41.56 12.63,41.12 R2.1 14.25,41.12 14.99,40.38 16.26,40.38 v16.51,40.63 17.14,41.27 | 17.14,41.27 19.75,41.27 21.34,42.85 21.45,42.85 21.53,42.93 23.43,42.93 23.87,42.5 26.69,42.5 26.79,42.6 v27.18,42.6 | 17.14,41.27 17.14,42.83 U1.7
  Bottom 0.203: v27.18,42.6 26.1,42.6 25.53,43.17 25.53,44.11 X8.3
CANL
  Top 0.203: U$10.P$3 4.68,44.19 7.37,44.19 8.48,43.08 C17.1 10.55,42.32 12.15,42.32 12.64,42.82 R2.2 13.56,43.65 14.36,44.44 17.78,44.44 18.05,44.17 U1.6 18.05,43.95 18.54,44.44 22.43,44.44 23.99,42.88 26.52,42.88 26.54,42.85 26.8,43.12 X8.2
DUPA  (via drill 0.35)
  Top 0.203: S2.1 S2.4 50.33,50.28 C11.1 45.56,52.78 23.05,52.78 23,52.82 v22.61,52.82 | v22.61,58.67 21.56,59.46 U$1.5
  Bottom 0.203: v22.61,52.82 v22.61,58.67
FLASH_CS  (via drill 0.35)
  Top 0.203: U2.33 37.67,39.36 v38.6,39.36 | v38.86,45.97 37.97,46.85 13.84,46.85 v13.46,46.47 | v13.46,14.98 R31.2
  Bottom 0.203: v38.6,39.36 38.86,39.63 v38.86,45.97 | v13.46,14.98 13.21,15.24 13.08,15.36 13.08,39.88 13.08,46.03 13.46,46.41 v13.46,46.47
FLASH_MISO  (via drill 0.35)
  Top 0.203: v37.08,48.26 36.66,47.85 15.27,47.85 14.99,48.12 9.78,48.12 v9.4,47.74 | v9.4,12.95 R30.2 | U2.35 36.25,39.81 v37.46,41.02
  Bottom 0.203: v9.4,47.74 v9.4,12.95 | v37.46,41.02 37.46,46.73 36.96,47.23 36.96,47.75 37.08,47.87 v37.08,48.26
FLASH_MOSI  (via drill 0.35)
  Top 0.203: U2.36 35.75,40.34 v36.55,41.14 | v36.17,48.51 11.43,48.51 v11.18,48.76 | v11.43,20.06 11.43,19.89 R19.2
  Bottom 0.203: v36.55,41.14 37.08,41.67 37.08,46.47 36.32,47.24 36.32,48.35 v36.17,48.51 | v11.18,48.76 11.18,20.31 v11.43,20.06
FLASH_RESET  (via drill 0.35)
  Top 0.203: U2.25 38.06,33.49 37.49,32.92 34.04,32.92 33.78,32.66 v33.78,32.64 | v33.53,30.73 31.11,30.73 v30.99,30.85 | v8.64,12.18 9.02,11.8 20.57,11.8 20.58,11.8 29.57,11.8 v29.72,11.65 | v8.77,17.01 R17.1
  Bottom 0.203: v33.78,32.64 33.53,32.38 v33.53,30.73 | v30.99,30.85 30.99,26.54 30.61,26.16 30.61,23.62 30.61,23.61 30.61,23.49 32,22.09 32,12.69 31.5,12.18 30.25,12.18 v29.72,11.65 | v8.64,12.18 8.64,16.88 v8.77,17.01
FLASH_SCK  (via drill 0.35)
  Top 0.203: v37.59,47.49 v14.73,47.49 | v13.97,21.07 R18.2 | v38.1,40.38 37.67,39.95 36.99,39.95 36.75,39.7 U2.34
  Bottom 0.203: v13.97,21.07 13.97,27.29 14.35,27.67 14.35,28.19 14.07,28.47 14.07,40.23 14.48,40.63 14.48,44.44 14.73,44.7 v14.73,47.49 | v38.1,40.38 38.1,46.98 v37.59,47.49
GND  (via drill 0.35)
  Top 0.203: v29.21,31.23 28.8,30.83 28.8,30.24 28.56,29.99 U2.63 | U2.18 38.26,29.99 38.11,29.84 37.85,29.84 37.34,29.32 35.77,29.32 v35.73,29.29 35.73,28.89 35.35,28.51 35.35,27.64 U2.12 | C20.2 12.69,50.39 U$2.P$3 U$2.P$2 | C19.2 10.64,36.63 | LED9.C 25.5,12.85 25.91,12.44 | U2.31 39.1,36.4 38.34,36.4 38.26,36.31 37.85,36.31
  Top 1.27: X3.21 X3.22 X3.23 X3.24 X3.25 50.81,3.29 v59.44,3.29
  Bottom 0.203: C1.2 30.11,31.23 v29.21,31.23 | C6.2 v35.78,31.49 35.78,29.33 v35.73,29.29
  Bottom 1.27: 61.37,42.5 U$3.P$2 | 61.37,42.5 C38.- | v59.44,3.29 60.45,4.31 60.45,12.44 63.5,15.49 63.5,40.38 61.38,42.5 61.37,42.5
  other vias: 29.97,35.55 31.5,35.55 22.61,39.62 27.18,39.62 28.96,39.62 29.21,42.92 21.34,49.27 28.7,51.3 23.11,51.55 21.84,53.59 19.05,53.33 18.54,55.36 10.67,53.84 9.4,51.05 9.4,49.27 12.7,49.27 6.6,49.52 6.6,47.49 6.6,53.84 6.86,42.16 12.19,44.7 6.6,44.95 15.49,41.39 11.94,46.98 6.86,35.3 14.73,25.39 8.38,27.17 5.08,28.19 6.1,30.47 4.83,35.3 12.19,34.79 12.19,30.73 17.78,23.36 3.56,21.33 5.08,12.18 5.08,15.23 1.52,11.93 1.52,13.45 23.88,13.96 21.59,13.96 25.91,19.3 25.91,23.11 27.37,22.85 28.19,27.42 28.45,26.66 48.51,31.74 53.34,25.9 57.66,25.9 52.83,33.77 60.71,37.84 58.93,42.66 57.4,43.93 58.17,45.71 56.9,46.47 49.78,47.24 49.02,49.01 50.04,51.3 53.34,53.08 57.15,55.11 54.86,55.36 44.7,64 50.04,61.46 48.77,57.4 48.77,63.49 32.51,59.94 32.26,64.76 33.78,65.78 40.64,66.03 47.5,66.54 29.97,66.54 26.16,64.25 21.08,64.51 18.8,61.71 18.54,64.76 17.53,62.22 13.72,59.68 19.3,57.65 27.18,58.41 31.5,57.65 32.26,55.62 27.94,55.36 32.51,53.59 27.69,53.59 32.26,50.79 41.91,49.52 34.8,50.54 58.93,49.52 59.44,52.82 63.75,53.08 61.47,55.11 58.67,38.35 52.07,39.11 54.86,39.87 59.94,20.31 58.17,17.77 46.74,40.63 49.53,43.17 55.12,46.47 14.73,30.73 8.38,30.73 14.99,27.17 6.6,27.17 16.51,22.85 60.71,18.03 39.12,28.69 39.62,26.88 42.02,26.87 46.23,26.7 50.04,28.73 50.04,30.51 49.28,34.83 42.06,34.6 38.25,38.16 43.08,41.2 41.16,40.16 42.43,45.97 43.01,47.57 43.19,49.52 54.62,44.19 48.51,53.33 36.98,36.12 7.37,37.33 6.86,39.87 20.57,43.43 14.71,39.32 46.34,35.31 55.12,4.56 53.09,4.82 50.29,6.34 56.9,12.18 58.42,21.58 62.74,11.93 65.02,8.37
  pour Top: 21.59,5.58 21.34,-1.53 0,-1.53 -2.79,1.26 -2.79,57.14 8.13,68.06 16,68.06 19.3,71.37 48.01,71.37 51.56,67.81 60.71,67.81 72.39,56.13 72.39,2.28 66.04,-4.07 39.12,-4.07 36.32,-1.28 36.32,3.8 36.83,4.31 36.83,5.83 37.08,6.09 40.13,6.09 41.15,7.1 41.15,9.14 42.42,10.41 54.1,10.41 55.12,11.42 55.12,20.82 53.09,22.85 53.09,25.14 52.32,25.9 51.82,25.39 38.61,25.39 37.08,26.92 33.02,26.92 28.7,22.6 28.19,22.6 26.16,20.57 26.16,14.98 26.92,13.96 26.92,10.41 24.64,10.41 23.11,8.88 23.11,7.36 22.1,6.34
  pour Bottom: 21.59,5.58 21.34,-1.53 0,-1.53 -2.79,1.26 -2.79,57.14 8.13,68.06 16,68.06 19.3,71.37 48.01,71.37 51.56,67.81 60.71,67.81 72.39,56.13 72.39,2.28 66.04,-4.07 39.12,-4.07 36.32,-1.28 36.32,3.8 36.83,4.31 36.83,5.83 37.08,6.09 40.13,6.09 41.15,7.1 41.15,9.14 42.42,10.41 54.1,10.41 55.12,11.42 55.12,20.82 53.09,22.85 53.09,25.14 52.32,25.9 51.82,25.39 38.61,25.39 37.08,26.92 33.02,26.92 28.7,22.6 28.19,22.6 26.16,20.57 26.16,14.98 26.92,13.96 26.92,10.41 24.64,10.41 23.11,8.88 23.11,7.36 22.1,6.34
GND1  (via drill 0.35)
  other vias: 43.99,18.75 44.67,22.6 50.16,22.75 42.76,15.14 51.87,12.72 51.87,15.51 51.87,18.3 51.61,20.34 47.8,20.34 47.8,19.07 48.31,17.54 43.01,11.84 39.42,9.86 37.64,7.69 52.16,16.92
  pour Bottom: 30.99,3.55 35.56,3.55 36.32,4.31 36.32,6.09 36.83,6.6 40.13,6.6 40.39,6.85 40.39,9.39 41.91,10.91 53.85,10.91 54.36,11.42 54.36,21.07 52.58,22.85 52.58,24.88 42.16,24.88 40.64,23.61 40.64,11.93 40.13,11.42 39.37,11.42 37.08,9.14 35.31,9.14 35.31,6.85 34.79,6.33 31,6.33 30.99,6.34
  pour Top: 30.99,3.55 35.56,3.55 36.32,4.31 36.32,6.09 36.83,6.6 40.13,6.6 40.39,6.85 40.39,9.39 41.91,10.91 53.85,10.91 54.36,11.42 54.36,21.07 52.58,22.85 52.58,24.88 42.16,24.88 40.64,23.61 40.64,11.93 40.13,11.42 39.37,11.42 37.08,9.14 35.31,9.14 35.31,6.85 34.79,6.33 31,6.33 30.99,6.34
IGN_TEST  (via drill 0.35)
  Top 0.203: v24.89,34.65 25.23,34.99 U2.53 | v27.43,18.53 24.89,18.53 24.28,19.15 v24.28,19.8
  Top 0.254: 45.8,18.33 R5.1 43.14,17.95 T1.C 39.89,18.33 39.81,18.25 38.15,18.25 37.71,18.68 30.66,18.68 30.03,18.05 29.74,18.05 29.21,17.52 v27.43,17.52
  Bottom 0.203: v27.43,17.52 v27.43,18.53 | v24.28,19.8 24.28,27.36 | 24.28,34.18 24.75,34.65 v24.89,34.65
  Bottom 0.254: 24.28,27.36 24.23,27.41 24.23,28.85 24.28,28.9 24.28,34.18
IGNITION  (via drill 0.35)
  Top 0.254: R25.1 41.22,20.15 v41.15,20.09 | v36.32,42.41 38.34,42.41 38.5,42.25 41.05,42.25 v41.4,41.9 | v35.55,41.14 35.25,40.84 U2.37
  Bottom 0.254: v41.15,20.09 41.15,25.73 41.3,25.88 41.3,34.94 41.91,35.55 41.91,41.39 v41.4,41.9 | v36.32,42.41 35.55,41.64 v35.55,41.14
KEY_IN  (via drill 0.35)
  Top 0.406: X3.19 33.59,6.85 v48.77,6.85 | v47.24,12.44 47.37,12.57 R12.1
  Top 1.27: v49.28,2.79 48.29,3.77 34.22,3.77 32.61,5.38 X3.19 | v51.82,10.15 v45.72,10.15 | v44.96,19.55 45.05,19.64 Q2.3
  Bottom 0.406: v48.77,6.85 48.77,10.66 47.24,12.18 v47.24,12.44
  Bottom 1.27: v49.28,2.79 51.82,5.33 v51.82,10.15 | v45.72,10.15 45.72,18.53 v44.96,19.55
KEY_OUT  (via drill 0.35)
  Top 0.406: v39.72,11.68 41.15,11.68 41.4,11.93 41.4,12.72 R3.1
  Bottom 0.406: X3.8 v39.72,11.68
  Bottom 1.27: X3.8 36.27,6.76 X3.20
KEY_TEST  (via drill 0.35)
  Top 0.203: T2.C 47.9,18.26 46.84,17.2 40.83,17.2 40.13,16.5 37.34,16.5 36.58,17.26 29.5,17.26 29.12,16.89 v23.79,16.89 v23.78,16.88 | v23.11,35.55 23.55,35.99 U2.51
  Top 0.254: T2.C 49.6,19.69 R21.1
  Bottom 0.203: v23.78,16.88 23.78,17.73 22.99,18.53 22.99,19.05 23.24,19.3 23.24,29.84 22.86,30.22 22.86,35.3 v23.11,35.55
MS56_CS  (via drill 0.35)
  Top 0.203: 17.02,49.14 U$2.P$4 | 17.02,49.14 U$2.P$5 | U2.20 43.29,30.99 43.68,30.6 44.2,30.6 44.58,30.98 v46.23,30.98 | v47.5,56.38 21.34,56.38 v21.08,56.63 | v19.81,49.14 17.02,49.14
  Bottom 0.203: v46.23,30.98 46.23,31.78 46.25,31.8 46.25,34.05 47.75,35.55 47.75,56.13 v47.5,56.38 | v21.08,56.63 21.08,50.41 v19.81,49.14
MS56_MISO  (via drill 0.35)
  Top 0.203: v40.64,34.03 40.64,33.75 41.11,33.27 41.11,32.75 40.36,31.99 U2.22 | v39.12,49.27 36.2,52.19 v18.99,52.19 | v18.8,50.03 18.43,50.39 U$2.P$6
  Bottom 0.203: v40.64,34.03 40.64,35.61 39.91,36.34 39.91,48.47 v39.12,49.27 | v18.99,52.19 18.8,52 v18.8,50.03
MS56_MOSI  (via drill 0.35)
  Top 0.203: U2.23 39.96,32.49 v40.48,33.01 | U$2.P$7 17.82,51.64 18.8,50.66 25.53,50.66 26.67,49.52 37.85,49.52 v38.1,49.27
  Bottom 0.203: v38.1,49.27 38.1,47.88 39.49,46.48 39.49,34 v40.48,33.01
MS56_SCLK  (via drill 0.35)
  Top 0.203: U2.21 43.68,31.49 v43.94,31.23 | v43.18,53.97 42.8,53.97 42.52,54.25 18.5,54.25 U$2.P$8
  Bottom 0.203: v43.94,31.23 43.94,34.02 44.08,34.16 44.08,53.07 v43.18,53.97
N$1  (via drill 0.35)
  Top 0.203: 8.29,22.85 R36.2 8.37,22.75 v6.31,22.75
  Bottom 0.203: v6.31,22.75 6.32,22.88 U$16.DETECT
N$2  (via drill 0.35)
  Top 0.203: 40.04,39.01 C18.1 | 40.04,39.01 40.2,38.85 | v41.15,36 v41.15,35.99 U2.30 | v41.15,38.09 40.23,39.01 40.04,39.01
  Bottom 0.203: v41.15,38.09 v41.15,36
N$3  (via drill 0.35)
  Top 0.203: v30.23,16.25 C25.1 33.36,14.98 R9.2 C26.2 | v30.48,22.6 31.02,22.6 U17.1
  Bottom 0.203: v30.23,16.25 30.23,22.34 v30.48,22.6
N$4  (via drill 0.35)
  Top 0.203: C27.1 R8.2 35.48,14.55 35.05,14.98 35.05,16.24 C25.2 35.31,16.5 v36.32,16.5
  Top 0.254: v35.05,18.03 U17.4
  Bottom 0.203: v36.32,16.5 35.05,17.77 v35.05,18.03
N$5
  Top 0.254: T1.B 41.81,14.88 R3.2 R4.2
N$6
  Top 0.406: R42.2 R32.1 45.27,45.23 U$17.3 43.41,45.2 41.91,45.2 41.49,44.78 R43.2
N$7
  Top 0.254: R14.1 54.61,52.34 LED1.A
N$8  (via drill 0.35)
  Top 0.203: 31.77,24.4 35.99,24.4 36.73,25.14 v41.91,25.14 | U2.5 31.75,26.41 v31.24,25.9
  Top 0.254: 31.77,24.4 v31.75,24.38
  Bottom 0.203: v31.75,24.38 31.24,24.88 v31.24,25.9 | v41.91,25.14 43.06,26.29 C8.2
  Bottom 0.254: Q1.3 42.89,26.54 C8.2
N$9  (via drill 0.35)
  Top 0.254: U2.6 32.25,26.42 32.51,26.15 v40.64,26.15 | v45.21,30.22 v40.64,30.22
  Bottom 0.203: Q1.1 45.29,30.3 v45.21,30.22
  Bottom 0.254: C9.2 45.29,34.45 Q1.1 44.94,32.85 | v40.64,30.22 v40.64,26.15
N$10
  Top 0.203: R10.1 29.48,19.3 U17.3
N$11
  Top 0.254: R15.2 LED2.A
N$12
  Top 0.254: R13.2 R12.2 48.47,15.88 T2.B
N$13  (via drill 0.35)
  Top 0.203: R7.2 20.07,24.14 v20.07,23.36 | v20.07,10.41 19.05,9.39 17.78,9.39 16.89,8.5 X3.1
  Bottom 0.203: v20.07,23.36 v20.07,10.41
N$14  (via drill 0.35)
  Top 0.254: R17.2 v13.97,17.01
  Bottom 0.254: v13.97,17.01 13.97,18.53 14.35,18.91 U$11.3
N$15
  Top 0.203: U17.2 29.48,20.57 R10.2
N$16  (via drill 0.35)
  Top 0.203: U17.7 v35.05,20.57 | v34.29,23.11 34.71,23.53 R11.1
  Bottom 0.203: v35.05,20.57 34.29,21.33 v34.29,23.11
N$17
  Bottom 1.27: U$3.P$1 63.65,51.21 D2.A
N$18  (via drill 0.35)
  Top 0.203: R14.2 52.85,48.59 52.39,48.12 44.58,48.12 44.45,48.25 38.1,48.25 37.21,49.14 37.09,49.14 37.08,49.14 v25.91,49.14 | v25.65,57.4 25.59,57.46 U$1.6
  Bottom 0.203: v25.91,49.14 25.65,49.39 v25.65,57.4
N$19  (via drill 0.35)
  Top 0.203: R15.1 55.96,48.59 v55.88,48.51 | v54.56,58.62 47.16,58.62 U$1.15
  Bottom 0.203: v55.88,48.51 55.88,57.55 54.81,58.62 v54.56,58.62
N$20
  Top 0.254: R5.2 46.18,14.16 LED4.C
N$21  (via drill 0.35)
  Top 0.254: R21.2 52.88,21.72 v52.96,21.65 | v52.96,15.17 LED3.C
  Bottom 0.254: v52.96,21.65 v52.96,15.17
N$23
  Top 0.203: 16.84,13.49 U$19.3 | 16.84,13.49 16.46,13.11 100.1 | 10K.2 C24.1 19.3,16.41 19.3,13.71 19.09,13.49 16.84,13.49
N$25  (via drill 0.35)
  Top 0.254: R18.1 10.33,21.33 v8.38,21.33
  Bottom 0.254: v8.38,21.33 8.26,21.46 U$11.16
N$26  (via drill 3.1)  (2 unrouted)
  other vias: 33.5,44.5 52,56.24 15,56.5
N$27  (via drill 3.1)  (1 unrouted)
  other vias: 3.5,5.5 63.5,5.5
N$28
  Top 0.254: R1.1 LED6.A
N$29  (via drill 0.35)
  Top 0.254: R20.2 18.54,14.78 v18.54,15.49 | v19.05,30.98 23.2,30.98 23.35,30.83 23.89,30.83 23.92,30.85 25.15,30.85 25.82,31.53 26.43,31.53 26.47,31.49 U2.60
  Bottom 0.254: v18.54,15.49 19.05,15.99 v19.05,30.98
N$30  (via drill 0.35)
  Top 0.254: R27.2 21.08,18.34 v21.08,18.79 | v21.08,33.27 21.81,33.99 U2.55
  Bottom 0.254: v21.08,18.79 v21.08,33.27
N$31
  Top 0.254: Q2.1 R6.2 47.33,23.7 R22.2
N$32  (via drill 0.35)
  Top 0.254: R19.1 v8.38,19.04
  Bottom 0.254: v8.38,19.04 8.38,19.8 8,20.19 U$11.15
N$33  (via drill 0.35)
  Top 0.203: v21.78,32.38 22.18,32.38 22.2,32.35
  Top 0.254: R28.2 21.95,18.61 v21.95,19.3 | U2.57 26.06,32.99 25.42,32.35 22.2,32.35
  Bottom 0.254: v21.95,19.3 21.49,19.76 21.49,31.98 arc-45 21.56,32.16 v21.78,32.38
N$34  (via drill 0.35)
  Top 0.254: R29.2 23.8,18.79 v23.62,18.79 | v23.62,31.49 24.08,31.95 25.59,31.95 25.63,31.99 U2.59
  Bottom 0.254: v23.62,18.79 v23.62,31.49
N$35
  Top 0.254: R25.2 43.48,23.25 R22.1 43.59,23.36 D1.A
N$36
  Top 0.203: LED7.A 20.39,15.94 R27.1
N$37
  Top 0.203: LED8.A 22.72,15.92 R28.1
N$38
  Top 0.203: LED9.A 25.05,15.84 R29.1
N$39  (via drill 0.35)
  Top 0.254: R30.1 v13.46,12.95
  Bottom 0.254: 15.26,12.69 U$11.8 15.38,12.58 14.25,12.58 13.88,12.95 v13.46,12.95
N$40  (via drill 0.35)
  Top 0.254: R31.1 11.6,13.96 v13.46,13.96
  Bottom 0.254: v13.46,13.96 15.26,13.96 U$11.7
N$41  (via drill 0.35)
  Top 0.203: R24.2 22.35,24.03 v22.35,23.37 | X3.2 21.21,9.77 21.6,9.77 21.98,10.15 v22.61,10.15
  Bottom 0.203: v22.35,23.37 22.35,19.79 22.58,19.56 22.58,10.18 v22.61,10.15
N$42  (via drill 0.35)
  Top 0.203: R35.2 25.4,23.76 v25,23.36 | v24.64,9.9 22.96,8.22 X3.3
  Bottom 0.203: v25,23.36 25,10.26 v24.64,9.9
NRST  (via drill 0.35)
  Top 0.203: v29.46,22.09 29.37,22 S1.4 S1.1 21.36,22.07 C10.1 9.09,22.07 9.04,22.01 5.84,22.01 5.76,22.01 5.61,22.01 arc45 5.43,21.94 v4.83,21.33 | U2.7 32.75,28.71 32.51,28.95 v29.72,28.95
  Bottom 0.203: v29.46,22.09 29.46,28.69 v29.72,28.95 | X1.2 4.39,18.1 arc-45 4.57,18.03 4.75,18.21 arc45 4.83,18.39 v4.83,21.33
SD_DETECT  (via drill 0.35)
  Top 0.203: v30.73,45.97 30.48,45.71 v2.03,45.71 | v2.03,24.63 2.17,24.49 C21.1 4.6,24.46 R36.1 | U2.38 34.75,40.43 v34.29,40.89
  Bottom 0.203: v30.73,45.97 30.8,43.87 33.78,40.89 v34.29,40.89 | v2.03,45.71 v2.03,24.63
SDIO_CK  (via drill 0.35)
  Top 0.203: U2.28 37.39,34.99 v37.19,34.79 | v37.08,29.96 32.78,29.96 32.52,30.21 29.52,30.21 v29.46,30.26 | v28.45,28.69 25.68,28.69 25.16,29.22 18.77,29.22 18.76,29.2 v5.08,29.2
  Bottom 0.203: v37.19,34.79 37.08,34.68 v37.08,29.96 | v29.46,30.26 29.46,29.71 v28.45,28.69 | v5.08,29.2 3.87,29.2 U$16.PIN5
SDIO_CMD  (via drill 0.35)
  Top 0.203: v14.92,31.62 v4.95,31.62 | v15.24,35.98 15.52,36.26 21.74,36.26 22.88,37.4 28.66,37.4 28.72,37.33 v29.21,37.33 | v29.21,34.54 27.84,34.54 U2.54
  Bottom 0.203: R38.1 16.76,29.96 v14.92,31.62 14.92,35.66 v15.24,35.98 | v29.21,37.33 v29.21,34.54
  Bottom 0.254: v4.95,31.62 3.72,31.62 U$16.PIN3
SDIO_D0  (via drill 0.35)
  Top 0.203: 13.21,27.93 v13.72,27.93 | v22.1,45.08 14.1,45.08 v13.97,44.95 | U2.39 34.25,39.91 32.7,41.52 32.33,41.52 32.26,41.53 22.56,41.53 v22.14,41.95
  Top 0.254: v13.72,27.93 v17.02,27.93 | 13.21,27.93 5.84,27.93 v5.08,27.17
  Bottom 0.203: v22.14,41.95 22.1,41.99 v22.1,45.08 | v13.97,44.95 13.72,44.7 v13.72,27.93
  Bottom 0.254: R37.1 v17.02,27.93 | v5.08,27.17 3.7,27.17 U$16.PIN7
SDIO_D1  (via drill 0.35)
  Top 0.203: U2.26 38.06,33.99 37.34,33.27 31.5,33.27 31.23,32.99 v30.23,32.99 | v27.43,26.15 27.05,25.77 26.66,25.77 26.44,25.55 19.92,25.55 19,24.63 v17.27,24.63
  Top 0.254: v17.27,24.63 15.75,26.15 v5.08,26.15
  Bottom 0.203: v30.23,32.99 28.18,32.99 27.43,32.25 v27.43,26.15
  Bottom 0.254: R40.1 17.27,24.97 v17.27,24.63 | v5.08,26.15 5.01,26.08 U$16.PIN8
SDIO_D2  (via drill 0.35)
  Top 0.203: v29.21,33.63 37.19,33.63 38.1,34.54 39.16,34.54 U2.27 | v17.53,40.63 19.81,40.63 19.94,40.76 19.94,40.84 21.68,42.58 22.95,42.58 23.62,41.9 27.92,41.9 v28.19,42.18
  Top 0.254: v16,35.3 14.48,33.77 v4.95,33.77
  Bottom 0.203: v16,35.3 17.4,36.69 17.4,36.7 17.53,36.84 v17.53,40.63 | v28.19,42.18 28.19,34.64 v29.21,33.63
  Bottom 0.254: v4.95,33.77 v4.95,33.78 U$16.PIN1 | R41.1 16.93,35.3 v16,35.3
SDIO_D3  (via drill 0.35)
  Top 0.203: U2.52 23.95,35.49 23.38,34.92 22.85,34.92 22.73,35.04 v19.05,35.04
  Top 0.254: v17.02,32 16.32,32.7 v4.95,32.7
  Bottom 0.203: R39.1 19.05,32.85 v19.05,35.04
  Bottom 0.254: v4.95,32.7 3.7,32.7 U$16.PIN2 | v17.02,32 R39.1
SERVO1_PWM  (via drill 0.35)
  Top 0.203: v25.15,33.01 25.63,33.49 U2.56 | v24.9,28.59 22.82,28.59 R7.1
  Bottom 0.203: v24.9,28.59 24.9,32.76 v25.15,33.01
SERVO2_PWM  (via drill 0.35)
  Top 0.203: v24.89,27.68 24.3,27.68 R24.1 | v26.16,30.87 26.28,30.99 U2.61
  Bottom 0.203: v26.16,30.87 26.16,30.86 25.53,30.23 25.53,28.32 v24.89,27.68
SERVO3_PWM  (via drill 0.35)
  Top 0.203: v26.16,29.96 26.67,30.47 28.19,30.47 28.17,30.49 U2.62 | v25.91,27.68 25.91,27 R35.1
  Bottom 0.203: v25.91,27.68 25.91,29.71 v26.16,29.96
SWCLK  (via drill 0.35)
  Top 0.203: U2.49 23.41,36.99 v22.1,35.68 | v22.15,29.96 7.75,29.96 v7.62,29.83
  Bottom 0.203: v22.1,35.68 22.1,33.37 arc45 22.17,33.19 22.5,32.86 22.5,30.43 arc-45 22.43,30.25 v22.15,29.96 | v7.62,29.83 7.62,26.41 5.99,24.77 3.19,24.77 1.78,23.36 1.78,17.01 1.94,16.85 X1.3
SWDIO  (via drill 0.35)
  Top 0.203: v1.4,38.85 1.65,39.11 8.13,39.11 8.38,39.36 9.73,39.36 9.88,39.51 13.36,39.51 14.1,40.25 14.61,40.25 14.91,39.95 15.83,39.95 16,39.95 21.76,39.95 22.27,40.46 30.48,40.46 30.75,40.19 U2.46 | v1.52,15.74 1.66,15.6 X1.4
  Bottom 0.203: v1.4,38.85 1.4,15.86 v1.52,15.74
TENSO_ADC  (via drill 0.35)
  Top 0.203: R11.2 C28.1 33.25,25.31
  Top 0.254: C28.1 32.17,25.23 v32.01,25.38 | U2.8 33.25,29.18 v33.27,29.2
  Bottom 0.254: v32.01,25.38 32.01,27.94 v33.27,29.2
TENSO_IN+  (via drill 0.35)
  Top 0.203: X3.16 25.28,6.85 v26.42,6.85 | R8.1 34.58,12.73 32.76,10.92 26.93,10.92 v26.42,10.41
  Bottom 0.203: v26.42,6.85 v26.42,10.41
TENSO_IN-  (via drill 0.35)
  Top 0.203: X3.17 27.93,6.73 v32.43,6.73 | v32.5,11.55 32.81,11.86 R9.1
  Bottom 0.203: v32.43,6.73 32.43,7.78 32.43,11.48 v32.5,11.55
UART_RX
  Top 0.203: U2.17 47.6,29.49 X2.2
UART_TX
  Top 0.203: U2.16 47.69,27.54 X2.3
XBEE_RX  (via drill 0.35)
  Top 0.203: U2.43 32.25,40 32.13,40.12 32.13,40.76 v32,40.89 | v28.96,65.46 U$1.2
  Bottom 0.203: v32,40.89 32,41.66 29.62,44.04 29.62,62.83 28.96,63.49 v28.96,65.46
XBEE_TX  (via drill 0.35)
  Top 0.203: U2.42 32.75,40.36 v32.77,40.38 | v29.97,63.49 29.94,63.46 U$1.3
  Bottom 0.203: v32.77,40.38 32.77,41.39 29.97,44.19 v29.97,63.49
XBEE_VDD  (via drill 0.35)
  Top 0.203: v37.08,67.56 21.1,67.56 U$1.1
  Bottom 0.203: C13.+ 38.06,66.58 v37.08,67.56
  Bottom 0.406: IC1.2 38.06,60.21 C30.1 38.27,63.39 C13.+

### Text on the board
tPlace: BartoszZ | Hybrid lower pcb vol2